# Altium project DC-DC_BuckBoost.PrjPcb (part 1 of 2)
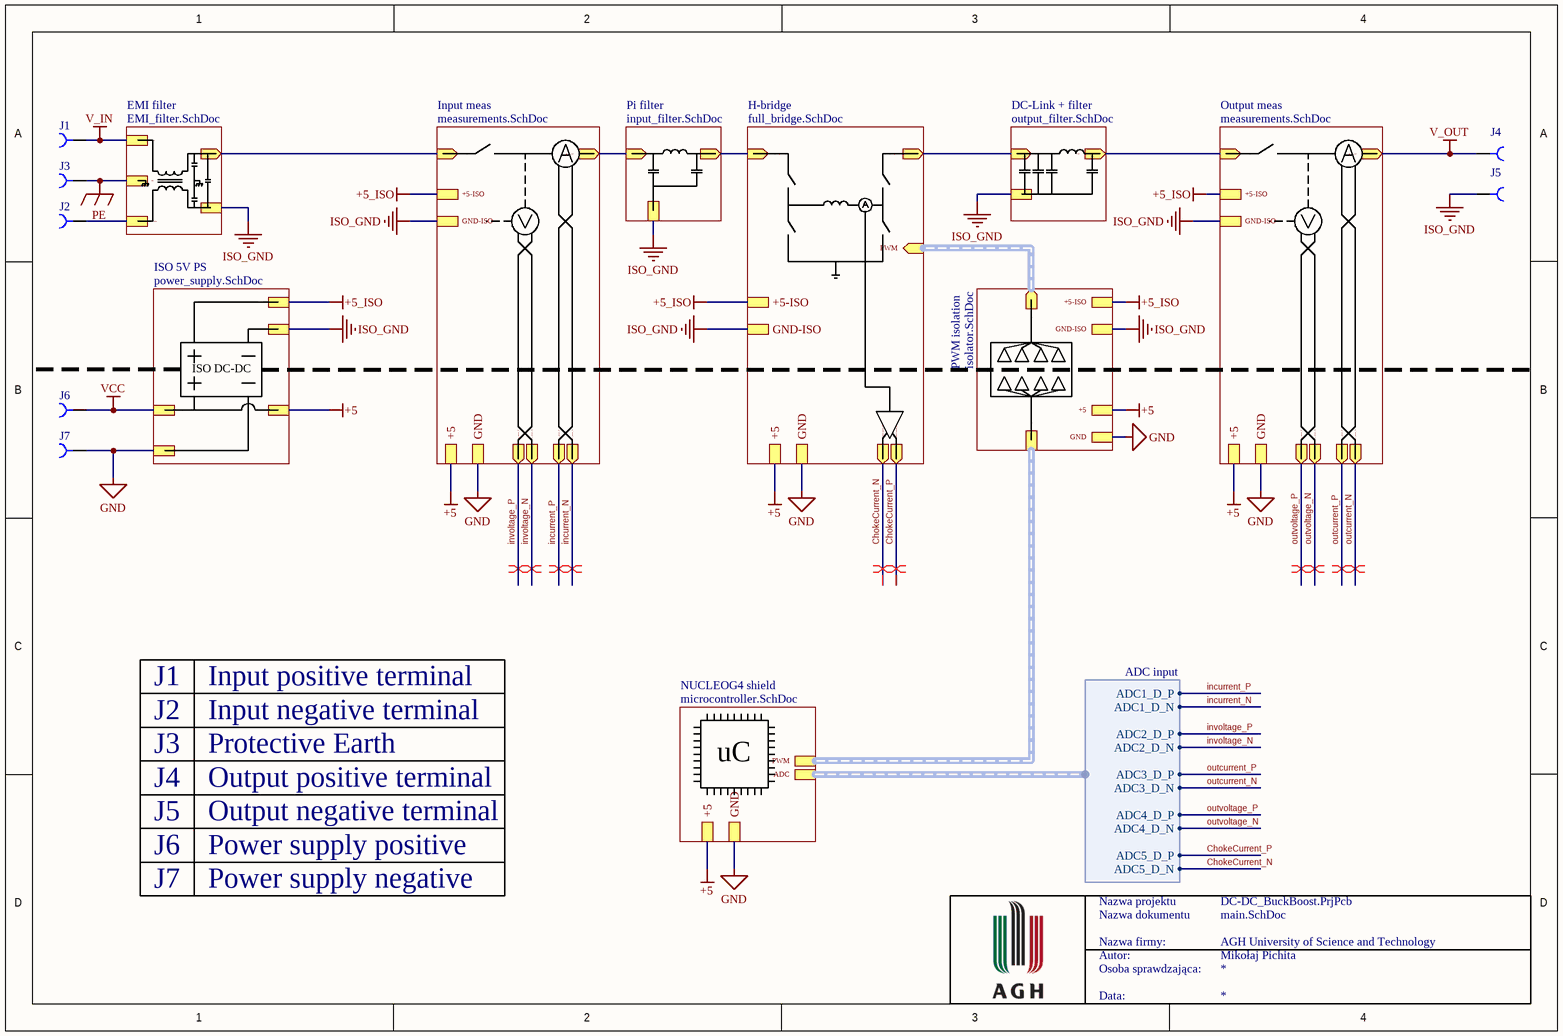
[diagram p0: main.SchDoc]
15 sheets, 255 parts. Net scope: strictly hierarchical (ports join the sheet entries above them; power ports are local).
Board file: PCB.PcbDoc
Sheets:
  main.SchDoc
    Output meas = measurements.SchDoc
      AMC3302 circuit = current_sense_shunt.SchDoc
      AMC3330 circuit = voltage_sense.SchDoc
      Protection = OV_OC.SchDoc
    Input meas = measurements.SchDoc
      AMC3302 circuit = current_sense_shunt.SchDoc
      AMC3330 circuit = voltage_sense.SchDoc
      Protection = OV_OC.SchDoc
    Pi filter = input_filter.SchDoc
    H-bridge = full_bridge.SchDoc
      Choke voltage = testpoint.SchDoc
      Designator = choke_current_meas.SchDoc
    DC-Link + filter = output_filter.SchDoc
    ISO 5V PS = power_supply.SchDoc
    PWM isolation = isolator.SchDoc
      PWM1and2 = testpoint.SchDoc
      PWM3and4 = testpoint.SchDoc
    NUCLEOG4 shield = microcontroller.SchDoc
    EMI filter = EMI_filter.SchDoc
  Drawing.SchDoc

## Sheet main.SchDoc
size A4; Author: Mikołaj Pichita; CompanyName: AGH University of Science and Technology; SheetNumber: 2; SheetTotal: 16

### Parts
J1  RED  [571-0X00]  (value not drawn)
J2  BLACK  [571-0X00]  (value not drawn)
J3  GREEN  [571-0X00]  (value not drawn)
J4  RED  [571-0X00]  (value not drawn)
J5  BLACK  [571-0X00]  (value not drawn)
J6  RED  [571-0X00]  (value not drawn)
J7  BLACK  [571-0X00]  (value not drawn)

### Sub-sheets
DC-Link + filter = output_filter.SchDoc: In (in), Out (out), GND-ISO
EMI filter = EMI_filter.SchDoc: Line, Return, NEG, POS (out), PE
H-bridge = full_bridge.SchDoc: Hi_side_in (in), Hi_side_out (out), PWM (in, harness Isolated PWM), ChokeCurrent_P (out), ChokeCurrent_N (out), +5-ISO, GND-ISO, +5, GND
Input meas = measurements.SchDoc: vs_meas_P (out), vs_meas_N (out), cs_meas_P (out), cs_meas_N (out), +5, GND, meas_in (in), meas_out (out), GND-ISO, +5-ISO
ISO 5V PS = power_supply.SchDoc: Vcc_in, +5, +5-ISO, GND, GND-ISO
NUCLEOG4 shield = microcontroller.SchDoc: PWM (harness Non isolated PWM), ADC (harness ADC input), +5, GND
Output meas = measurements.SchDoc: vs_meas_P (out), vs_meas_N (out), cs_meas_P (out), cs_meas_N (out), +5, GND, meas_in (in), meas_out (out), GND-ISO, +5-ISO
Pi filter = input_filter.SchDoc: In (in), Out (out), GND-ISO
PWM isolation = isolator.SchDoc: iso_out (out, harness Isolated PWM), iso_in (harness Non isolated PWM), +5-ISO, GND-ISO, +5, GND

### Harnesses
ADC input: ADC1_D_N, ADC1_D_P, ADC2_D_N, ADC2_D_P, ADC3_D_N, ADC3_D_P, ADC4_D_N, ADC4_D_P, ADC5_D_P, ADC5_D_N

### Nets
+5: sheet Output meas/+5, sheet Input meas/+5, sheet H-bridge/+5, sheet ISO 5V PS/+5, sheet PWM isolation/+5, sheet NUCLEOG4 shield/+5
+5_ISO: sheet Output meas/+5-ISO, sheet Input meas/+5-ISO, sheet H-bridge/+5-ISO, sheet ISO 5V PS/+5-ISO, sheet PWM isolation/+5-ISO
GND: J7.1 ; sheet Output meas/GND, sheet Input meas/GND, sheet H-bridge/GND, sheet ISO 5V PS/GND, sheet PWM isolation/GND, sheet NUCLEOG4 shield/GND
ISO_GND: J5.1 ; sheet Output meas/GND-ISO, sheet Input meas/GND-ISO, sheet Pi filter/GND-ISO, sheet H-bridge/GND-ISO, sheet DC-Link + filter/GND-ISO, sheet ISO 5V PS/GND-ISO, sheet PWM isolation/GND-ISO, sheet EMI filter/NEG
PE: J3.1 ; sheet EMI filter/PE
V_IN: J1.1 ; sheet EMI filter/Line
V_OUT: J4.1 ; sheet Output meas/meas_out
VCC: J6.1 ; sheet ISO 5V PS/Vcc_in
ChokeCurrent_N: sheet H-bridge/ChokeCurrent_N, sheet NUCLEOG4 shield/ADC.ADC5_D_N
ChokeCurrent_P: sheet H-bridge/ChokeCurrent_P, sheet NUCLEOG4 shield/ADC.ADC5_D_P
FltrIn: sheet Input meas/meas_out, sheet Pi filter/In
incurrent_N: sheet Input meas/cs_meas_N, sheet NUCLEOG4 shield/ADC.ADC1_D_N
incurrent_P: sheet Input meas/cs_meas_P, sheet NUCLEOG4 shield/ADC.ADC1_D_P
involtage_N: sheet Input meas/vs_meas_N, sheet NUCLEOG4 shield/ADC.ADC2_D_N
involtage_P: sheet Input meas/vs_meas_P, sheet NUCLEOG4 shield/ADC.ADC2_D_P
outcurrent_N: sheet Output meas/cs_meas_N, sheet NUCLEOG4 shield/ADC.ADC3_D_N
outcurrent_P: sheet Output meas/cs_meas_P, sheet NUCLEOG4 shield/ADC.ADC3_D_P
OutFltr: sheet Output meas/meas_in, sheet DC-Link + filter/Out
outvoltage_N: sheet Output meas/vs_meas_N, sheet NUCLEOG4 shield/ADC.ADC4_D_N
outvoltage_P: sheet Output meas/vs_meas_P, sheet NUCLEOG4 shield/ADC.ADC4_D_P
Return: J2.1 ; sheet EMI filter/Return
VCCFltr: sheet Input meas/meas_in, sheet EMI filter/POS
Vin: sheet Pi filter/Out, sheet H-bridge/Hi_side_in
Vout: sheet H-bridge/Hi_side_out, sheet DC-Link + filter/In

### Buses and harness runs
harness sheet H-bridge/PWM = sheet PWM isolation/iso_out
harness sheet NUCLEOG4 shield/PWM = sheet PWM isolation/iso_in

### Layout directives
differential pair: ChokeCurrent_N, ChokeCurrent_P, incurrent_N, incurrent_P, involtage_N, involtage_P, outcurrent_N, outcurrent_P, outvoltage_N, outvoltage_P

### Notes on the sheet
- ISO DC-DC
- J1
- Input positive terminal
- J2
- J3
- J4
- Input negative terminal
- Protective Earth
- Output positive terminal
- uC
- J5
- Output negative terminal
- J6
- J7
- Power supply positive
- Power supply negative
- Nazwa projektu
- Nazwa dokumentu
- Nazwa firmy:
- Autor:
- Osoba sprawdzająca:
- Data:

### Library data of the parts
J1-J7 = Banana connector: Value: *; HelpURL: *; MPN: *; Supplier: *; SupplierPartNumber: *

## Sheet measurements.SchDoc
size A4; Date: 04.12.2023; ApprovedBy: Cezary Worek; Author: Mikołaj Pichita; CompanyName: AGH University of Science and Technology; SheetNumber: 12; SheetTotal: 16
Used 2 times, as channels Output meas, Input meas. Parts and nets are listed once, with the designators drawn on the sheet.
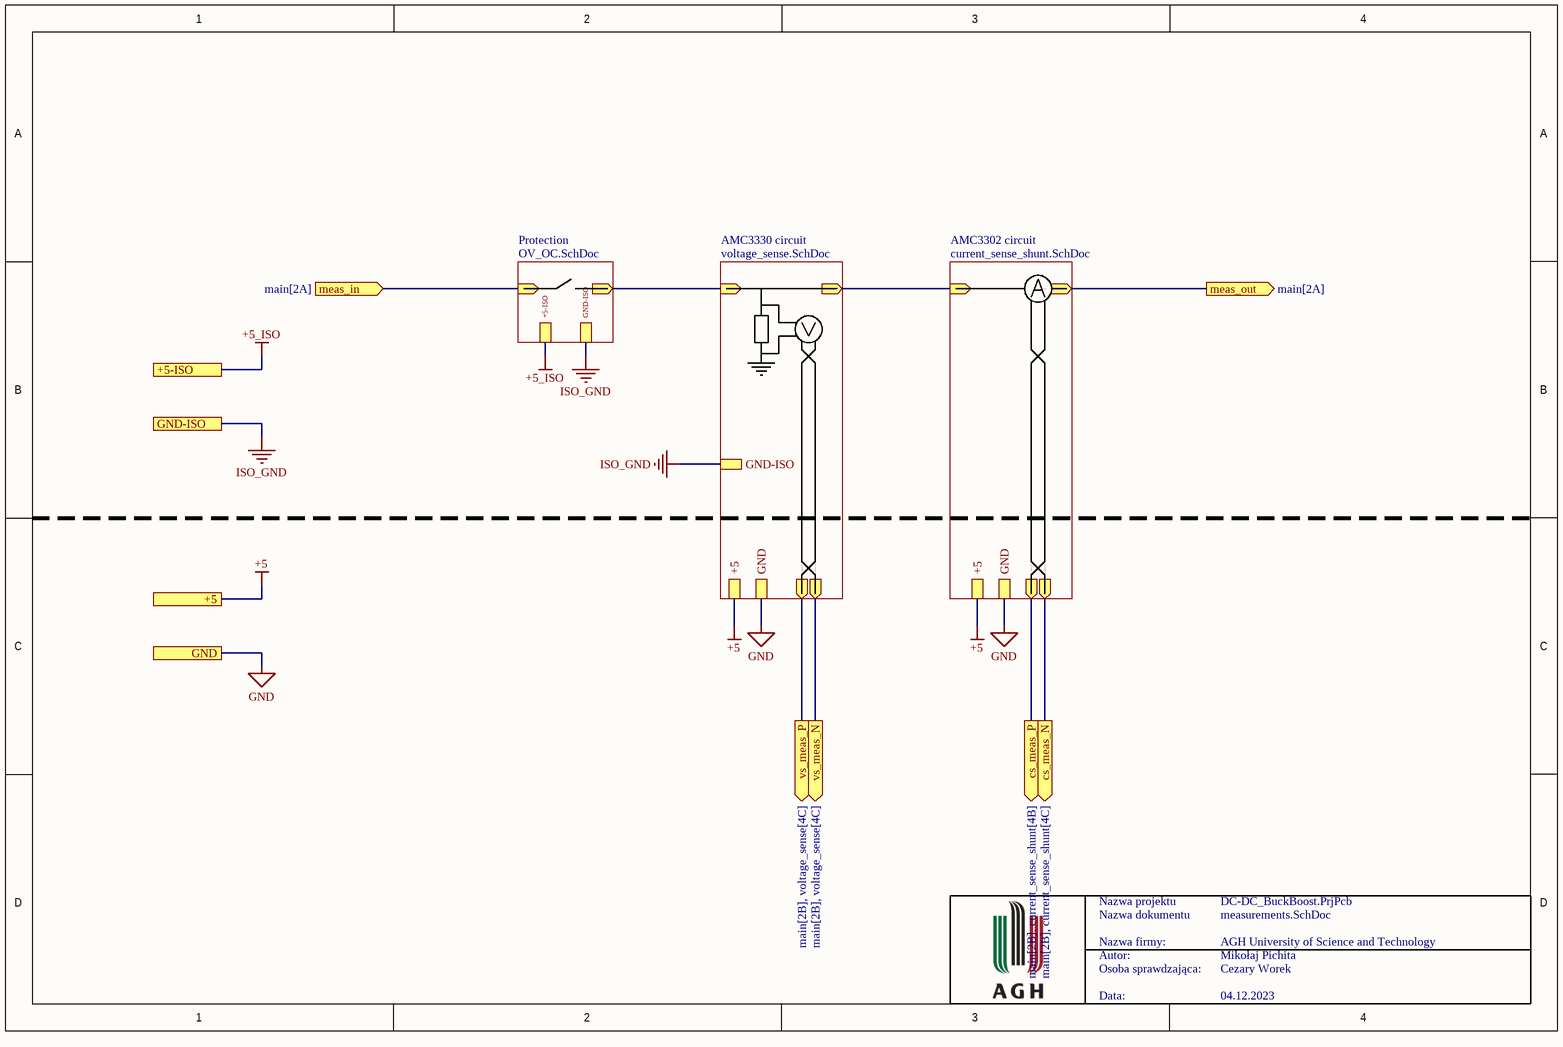
[diagram p1: measurements.SchDoc]

### Sub-sheets
AMC3302 circuit = current_sense_shunt.SchDoc: cs_in (in), cs_out (out), cs_meas_P (out), cs_meas_N (out), +5, GND
AMC3330 circuit = voltage_sense.SchDoc: vs_in (in), vs_out (out), vs_meas_P (out), vs_meas_N (out), +5, GND, GND-ISO
Protection = OV_OC.SchDoc: In (in), Out (out), +5-ISO, GND-ISO

### Ports
+5 (see main[2B], choke_current_meas[4B], current_sense_shunt[4A], full_bridge[1C], isolator[1B], microcontroller[1C], power_supply[2B], voltage_sense[4A]), +5-ISO (see main[2A], full_bridge[1B], isolator[4B], OV_OC[1B], power_supply[3B], testpoint[2A]), cs_meas_N (out, see main[2B], current_sense_shunt[4C]), cs_meas_P (out, see main[2B], current_sense_shunt[4B]), GND (see main[2B], choke_current_meas[4B], current_sense_shunt[4B], full_bridge[1D], isolator[1B], microcontroller[1C], power_supply[1B], voltage_sense[4B]), GND-ISO (see main[2A], full_bridge[1B], input_filter[2C], isolator[4B], output_filter[1B], OV_OC[1B], power_supply[3B], testpoint[2A], voltage_sense[1B]), meas_in (in, see main[2A]), meas_out (out, see main[2A]), vs_meas_N (out, see main[2B], voltage_sense[4C]), vs_meas_P (out, see main[2B], voltage_sense[4C])

### Nets
+5: port +5, sheet AMC3302 circuit/+5, sheet AMC3330 circuit/+5
+5_ISO: port +5-ISO, sheet Protection/+5-ISO
GND: port GND, sheet AMC3302 circuit/GND, sheet AMC3330 circuit/GND
ISO_GND: port GND-ISO, sheet AMC3330 circuit/GND-ISO, sheet Protection/GND-ISO
cs_meas_N: port cs_meas_N, sheet AMC3302 circuit/cs_meas_N
cs_meas_P: port cs_meas_P, sheet AMC3302 circuit/cs_meas_P
meas_in: port meas_in, sheet Protection/In
meas_out: port meas_out, sheet AMC3302 circuit/cs_out
vs_meas_N: port vs_meas_N, sheet AMC3330 circuit/vs_meas_N
vs_meas_P: port vs_meas_P, sheet AMC3330 circuit/vs_meas_P
(unnamed): sheet AMC3302 circuit/cs_in, sheet AMC3330 circuit/vs_out
(unnamed): sheet AMC3330 circuit/vs_in, sheet Protection/Out

### Channels
Output meas: ports +5-ISO=+5_ISO +5=+5 cs_meas_N=outcurrent_N cs_meas_P=outcurrent_P GND-ISO=ISO_GND GND=GND meas_in=OutFltr meas_out=V_OUT vs_meas_N=outvoltage_N vs_meas_P=outvoltage_P
Input meas: ports +5-ISO=+5_ISO +5=+5 cs_meas_N=incurrent_N cs_meas_P=incurrent_P GND-ISO=ISO_GND GND=GND meas_in=VCCFltr meas_out=FltrIn vs_meas_N=involtage_N vs_meas_P=involtage_P

### Notes on the sheet
- Nazwa projektu
- Nazwa dokumentu
- Nazwa firmy:
- Autor:
- Osoba sprawdzająca:
- Data:

## Sheet current_sense_shunt.SchDoc
size A4; Author: Mikołaj Pichita; CompanyName: AGH University of Science and Technology; SheetNumber: 15; SheetTotal: 16
Used 2 times, as channels Output meas/AMC3302 circuit, Input meas/AMC3302 circuit. Parts and nets are listed once, with the designators drawn on the sheet.
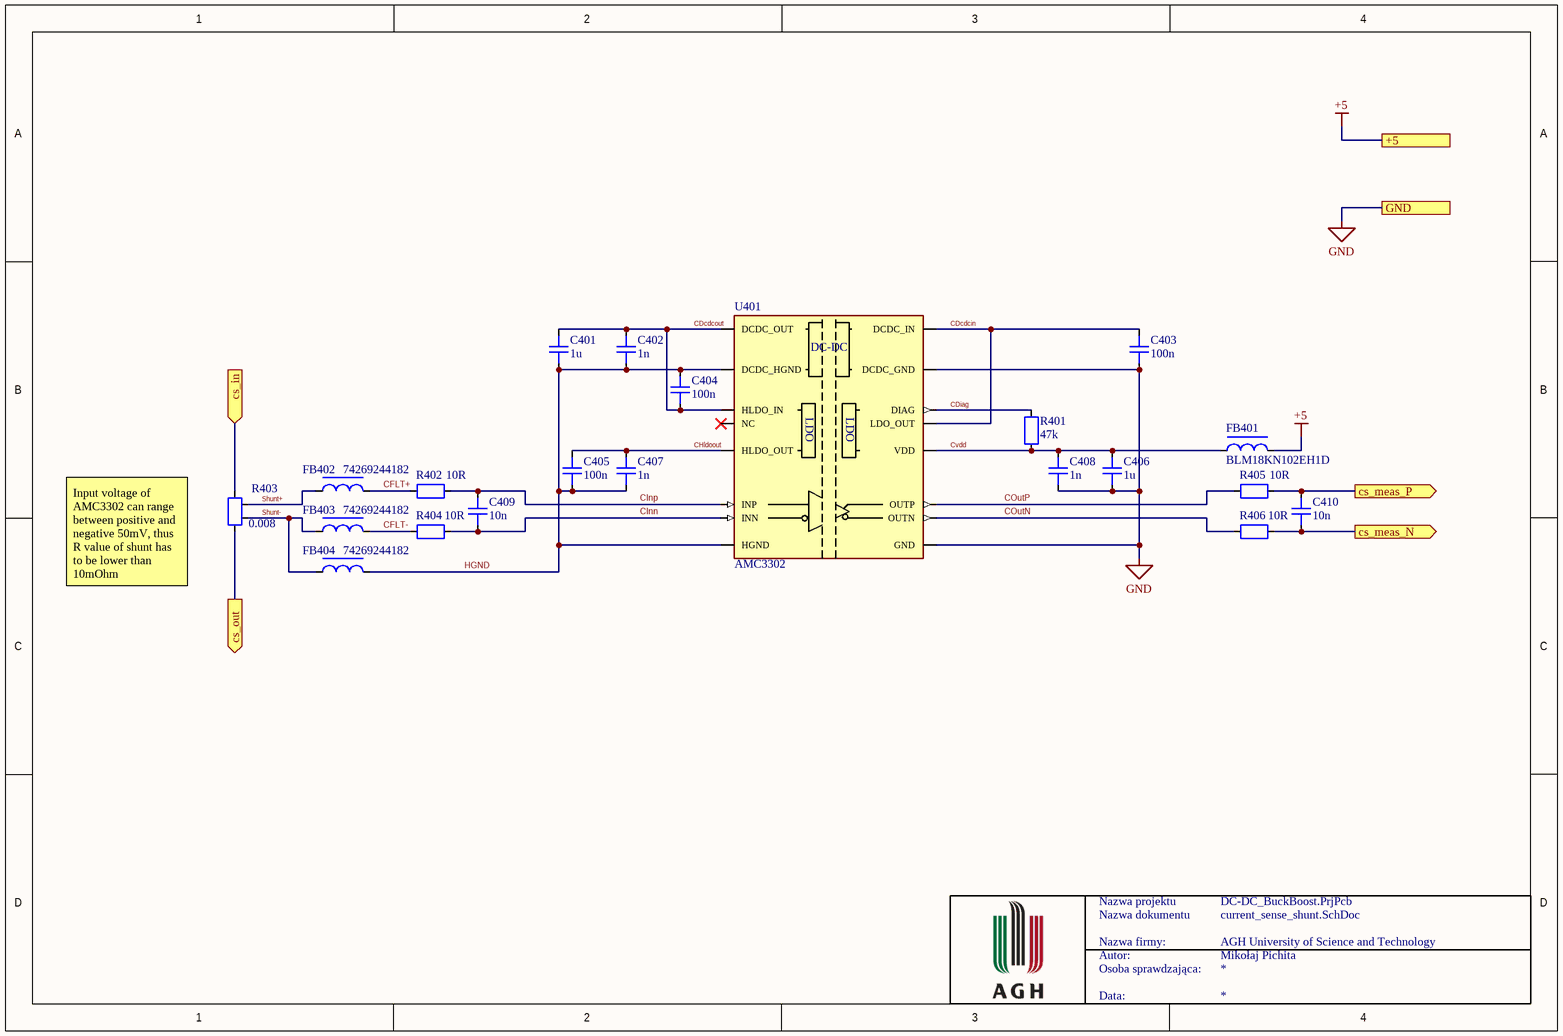
[diagram p2: current_sense_shunt.SchDoc]

### Parts
C401  1u  [CAP1206]
C402  1n  [CAP0603]
C403  100n  [CAP0603]
C404  100n  [CAP0603]
C405  100n  [CAP0603]
C406  1u  [CAP1206]
C407  1n  [CAP0603]
C408  1n  [CAP1206]
C409  10n  [CAP0603]
C410  10n  [CAP0603]
FB401  BLM18KN102EH1D  [RES0603]
FB402  74269244182  [FB0402]
FB403  74269244182  [FB0402]
FB404  74269244182  [FB0402]
R401  47k  [RES0603]
R402  10R  [RES0603]
R403  0.008  [WSL3637]
R404  10R  [RES0603]
R405  10R  [RES0603]
R406  10R  [RES0603]
U401  AMC3302  [SOIC127P1030X265-16N]

### Ports
+5 (see measurements[3C], choke_current_meas[4B], full_bridge[1C], isolator[1B], measurements[1C], microcontroller[1C], power_supply[2B], voltage_sense[4A]), cs_in (in, see measurements[3B]), cs_meas_N (out, see measurements[3C], measurements[3D]), cs_meas_P (out, see measurements[3C], measurements[3D]), cs_out (out, see measurements[3B]), GND (see measurements[3C], choke_current_meas[4B], full_bridge[1D], isolator[1B], measurements[1C], microcontroller[1C], power_supply[1B], voltage_sense[4B])

### Nets
+5: FB401.1 ; port +5
GND: C403.2 C406.2 C408.2 U401.9(GND) U401.15(DCDC_GND) ; port GND
CDcdcin: C403.1 U401.13(LDO_OUT) U401.16(DCDC_IN)
CDcdcout: C401.1 C402.1 C404.2 U401.1(DCDC_OUT) U401.3(HLDO_IN)
CDiag: R401.1 U401.14(DIAG)
CFLT+: FB402.2 R402.2
CFLT-: FB403.2 R404.2
CHldoout: C405.1 C407.1 U401.5(HLDO_OUT)
CInn: C409.1 R404.1 U401.7(INN)
CInp: C409.2 R402.1 U401.6(INP)
COutN: R406.2 U401.10(OUTN)
COutP: R405.2 U401.11(OUTP)
cs_in: R403.1 ; port cs_in
cs_meas_N: C410.1 R406.1 ; port cs_meas_N
cs_meas_P: C410.2 R405.1 ; port cs_meas_P
cs_out: R403.2 ; port cs_out
Cvdd: C406.1 C408.1 FB401.2 R401.2 U401.12(VDD)
HGND: C401.2 C402.2 C404.1 C405.2 C407.2 FB404.2 U401.2(DCDC_HGND) U401.8(HGND)
Shunt+: FB402.1 R403.4
Shunt-: FB403.1 FB404.1 R403.3

Not connected (* = marked no-connect by the designer): U401 4(NC)*

### Channels
Output meas/AMC3302 circuit: designators end in A; ports +5=+5 cs_in=VCCProt cs_meas_N=outcurrent_N cs_meas_P=outcurrent_P cs_out=V_OUT GND=GND
Input meas/AMC3302 circuit: designators end in B; ports +5=+5 cs_in=VCCProt cs_meas_N=incurrent_N cs_meas_P=incurrent_P cs_out=FltrIn GND=GND

### Notes on the sheet
- (near R403) Input voltage of AMC3302 can range between positive and negative 50mV, thus R value of shunt has to be lower than 10mOhm
- Nazwa projektu
- Nazwa dokumentu
- Nazwa firmy:
- Autor:
- Osoba sprawdzająca:
- Data:
- (in symbol AMC3302) DC-DC; LDO

### Library data of the parts
C401-C410 = Capacitor: Value: *; HelpURL: *; MPN: *; Supplier: *; SupplierPartNumber: *; Supplier 1: Mouser
  C401 C406: Supplier Part Number 1: 581-12065C105K4Z4A
  C402 C407: Supplier Part Number 1: 581-0603YC102J4T2A
  C403-C405: Supplier Part Number 1: 581-06035C104KAT2A
  C408: Supplier Part Number 1: 581-1206GC102KAT3A
  C409 C410: Supplier Part Number 1: 581-06035C103K
FB401-FB404 = Ferrite Bead: Value: *; HelpURL: *; MPN: *; Supplier: *; SupplierPartNumber: *; Supplier 1: Mouser
  FB401: Supplier Part Number 1: 81-BLM18KN102EH1D
  FB402-FB404: Supplier Part Number 1: 710-74269244182
R401 R402 R404-R406 = Resistor: Value: *; HelpURL: *; MPN: *; Supplier: *; SupplierPartNumber: *; Supplier 1: Mouser
  R401: Supplier Part Number 1: 603-RP0603BRD0747KL
  R402 R404-R406: Supplier Part Number 1: 603-RP0603BRD0710RL
R403 = Shunt resistor: 0.008 Ohm Current Sense Resistor; Value: *; HelpURL: *; MPN: *; Supplier: *; SupplierPartNumber: *; Supplier 1: Mouser; Supplier Part Number 1: 71-WSL36378L000FEA
U401 = AMC3302: ±50-mV input, precision current sensing reinforced isolated amplifier with integrated DC/DC; Value: *; HelpURL: *; MPN: *; Supplier: *; SupplierPartNumber: *

## Sheet voltage_sense.SchDoc
size A4; Author: Mikołaj Pichita; CompanyName: AGH University of Science and Technology; SheetNumber: 14; SheetTotal: 16
Used 2 times, as channels Output meas/AMC3330 circuit, Input meas/AMC3330 circuit. Parts and nets are listed once, with the designators drawn on the sheet.
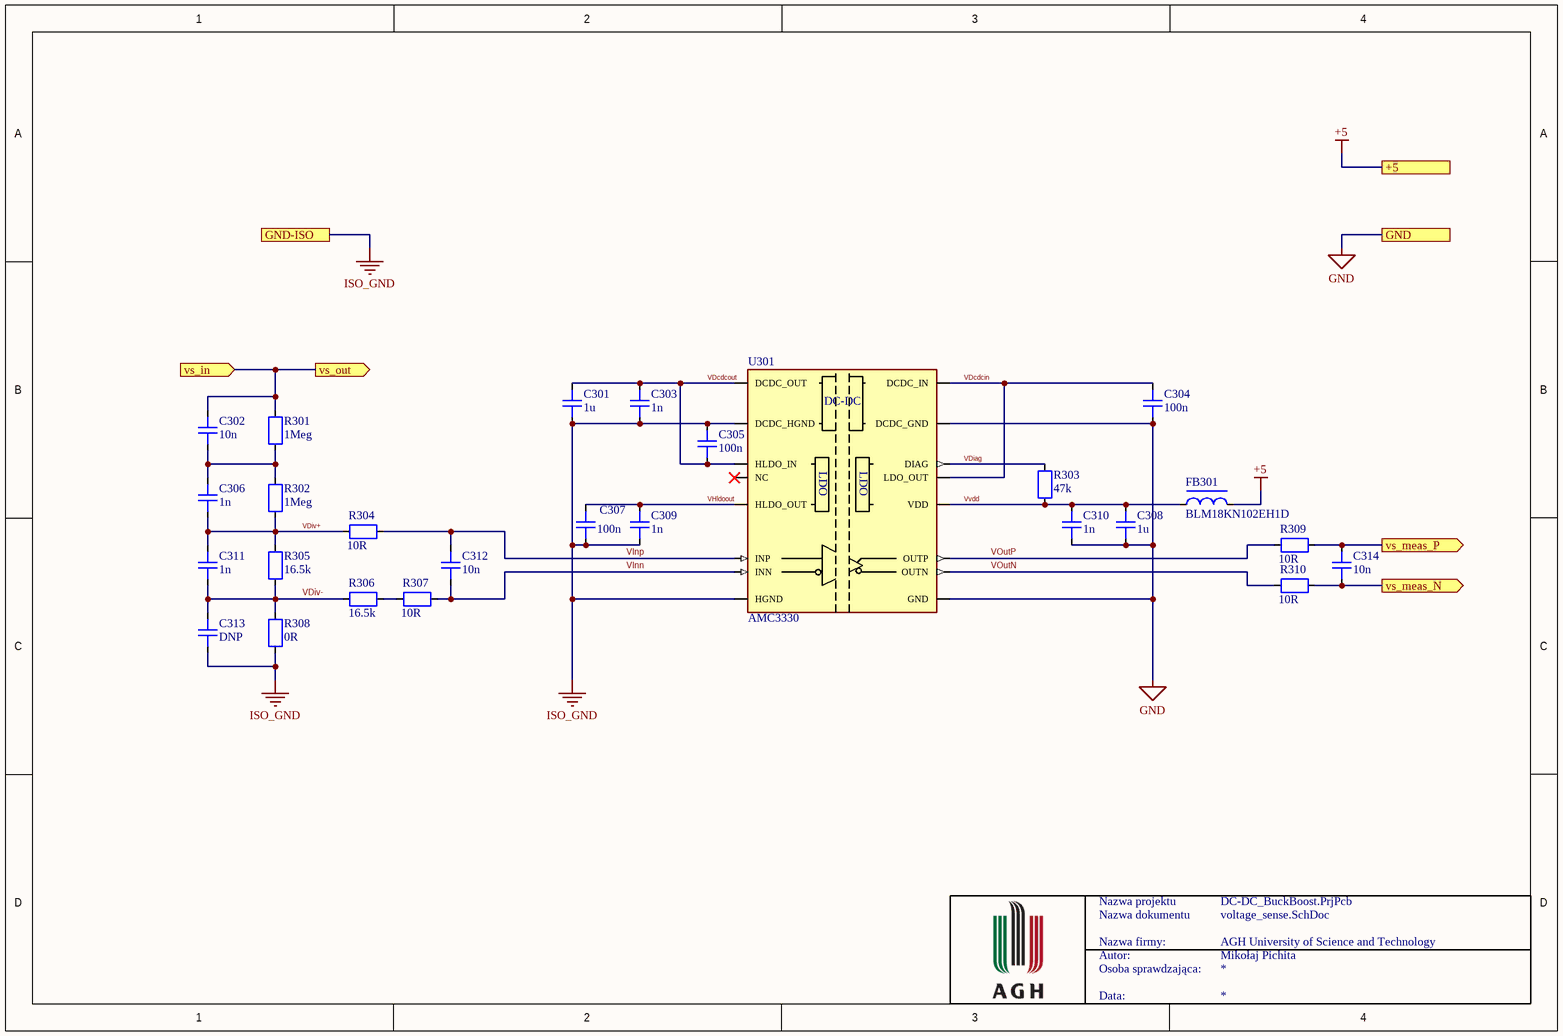
[diagram p3: voltage_sense.SchDoc]

### Parts
C301  1u  [CAP1206]
C302  10n  [CAP0603]
C303  1n  [CAP0603]
C304  100n  [CAP0603]
C305  100n  [CAP0603]
C306  1n  [CAP0603]
C307  100n  [CAP0603]
C308  1u  [CAP1206]
C309  1n  [CAP0603]
C310  1n  [CAP1206]
C311  1n  [CAP0603]
C312  10n  [CAP0603]
C313  DNP  [CAP0603]  (no BOM)
C314  10n  [CAP0603]
FB301  BLM18KN102EH1D  [RES0603]
R301  1Meg  [RES0603]
R302  1Meg  [RES0603]
R303  47k  [RES0603]
R304  10R  [RES0603]
R305  16.5k  [RES0603]
R306  16.5k  [RES0603]
R307  10R  [RES0603]
R308  0R  [RES0603]
R309  10R  [RES0603]
R310  10R  [RES0603]
U301  AMC3330  [SOIC127P1030X265-16N]

### Ports
+5 (see measurements[2C], choke_current_meas[4B], current_sense_shunt[4A], full_bridge[1C], isolator[1B], measurements[1C], microcontroller[1C], power_supply[2B]), GND (see measurements[2C], choke_current_meas[4B], current_sense_shunt[4A], full_bridge[1D], isolator[1B], measurements[1C], microcontroller[1C], power_supply[1B]), GND-ISO (see measurements[2B], full_bridge[1B], input_filter[2C], isolator[4B], measurements[1B], output_filter[1B], OV_OC[1B], power_supply[3B], testpoint[1A]), vs_in (in, see measurements[2B]), vs_meas_N (out, see measurements[3C], measurements[3D]), vs_meas_P (out, see measurements[3C], measurements[3D]), vs_out (out, see measurements[3B])

### Nets
+5: FB301.1 ; port +5
GND: C304.2 C308.2 C310.2 U301.9(GND) U301.15(DCDC_GND) ; port GND
ISO_GND: C301.2 C303.2 C305.1 C307.2 C309.2 C313.2 R308.2 U301.2(DCDC_HGND) U301.8(HGND) ; port GND-ISO
VDcdcin: C304.1 U301.13(LDO_OUT) U301.16(DCDC_IN)
VDcdcout: C301.1 C303.1 C305.2 U301.1(DCDC_OUT) U301.3(HLDO_IN)
VDiag: R303.1 U301.14(DIAG)
VDiv+: C306.2 C311.1 R302.2 R304.2 R305.1
VDiv-: C311.2 C313.1 R305.2 R306.1 R308.1
VHldoout: C307.1 C309.1 U301.5(HLDO_OUT)
VInn: C312.1 R307.1 U301.7(INN)
VInp: C312.2 R304.1 U301.6(INP)
VOutN: R310.2 U301.10(OUTN)
VOutP: R309.2 U301.11(OUTP)
vs_in: C302.1 R301.1 ; port vs_in, port vs_out
vs_meas_N: C314.1 R310.1 ; port vs_meas_N
vs_meas_P: C314.2 R309.1 ; port vs_meas_P
Vvdd: C308.1 C310.1 FB301.2 R303.2 U301.12(VDD)
NetC302_2: C302.2 C306.1 R301.2 R302.1
NetR306_2: R306.2 R307.2

Not connected (* = marked no-connect by the designer): U301 4(NC)*

### Channels
Output meas/AMC3330 circuit: designators end in A; ports +5=+5 GND-ISO=ISO_GND GND=GND vs_in=VCCProt vs_meas_N=outvoltage_N vs_meas_P=outvoltage_P vs_out=VCCProt
Input meas/AMC3330 circuit: designators end in B; ports +5=+5 GND-ISO=ISO_GND GND=GND vs_in=VCCProt vs_meas_N=involtage_N vs_meas_P=involtage_P vs_out=VCCProt

### Notes on the sheet
- Nazwa projektu
- Nazwa dokumentu
- Nazwa firmy:
- Autor:
- Osoba sprawdzająca:
- Data:
- (in symbol AMC3330) DC-DC; LDO

### Library data of the parts
C301-C314 = Capacitor: Value: *; HelpURL: *; MPN: *; Supplier: *; SupplierPartNumber: *
  C301 C308: Supplier 1: Mouser; Supplier Part Number 1: 581-12065C105K4Z4A
  C303 C309: Supplier 1: Mouser; Supplier Part Number 1: 581-0603YC102J4T2A
  C304 C305 C307: Supplier 1: Mouser; Supplier Part Number 1: 581-06035C104KAT2A
  C310: Supplier 1: Mouser; Supplier Part Number 1: 581-1206GC102KAT3A
  C312 C314: Supplier 1: Mouser; Supplier Part Number 1: 581-06035C103K
FB301 = Ferrite Bead: Value: *; HelpURL: *; MPN: *; Supplier: *; SupplierPartNumber: *; Supplier 1: Mouser; Supplier Part Number 1: 81-BLM18KN102EH1D
R301-R310 = Resistor: Value: *; HelpURL: *; MPN: *; Supplier: *; SupplierPartNumber: *; Supplier 1: Mouser
  R301 R302 R308: Supplier Part Number 1: 667-ERJ-UP3F1004V
  R303: Supplier Part Number 1: 603-RP0603BRD0747KL
  R304 R307 R309 R310: Supplier Part Number 1: 603-RP0603BRD0710RL
  R305 R306: Supplier Part Number 1: 603-RT0603DRE0716K5L
U301 = AMC3330: ±1-V input, precision voltage sensing reinforced isolated amplifier with integrated DC/DC; Value: *; HelpURL: *; MPN: *; Supplier: *; SupplierPartNumber: *

## Sheet OV_OC.SchDoc
size A4; Author: Mikołaj Pichita; CompanyName: AGH University of Science and Technology; SheetNumber: 13; SheetTotal: 16
Used 2 times, as channels Output meas/Protection, Input meas/Protection. Parts and nets are listed once, with the designators drawn on the sheet.
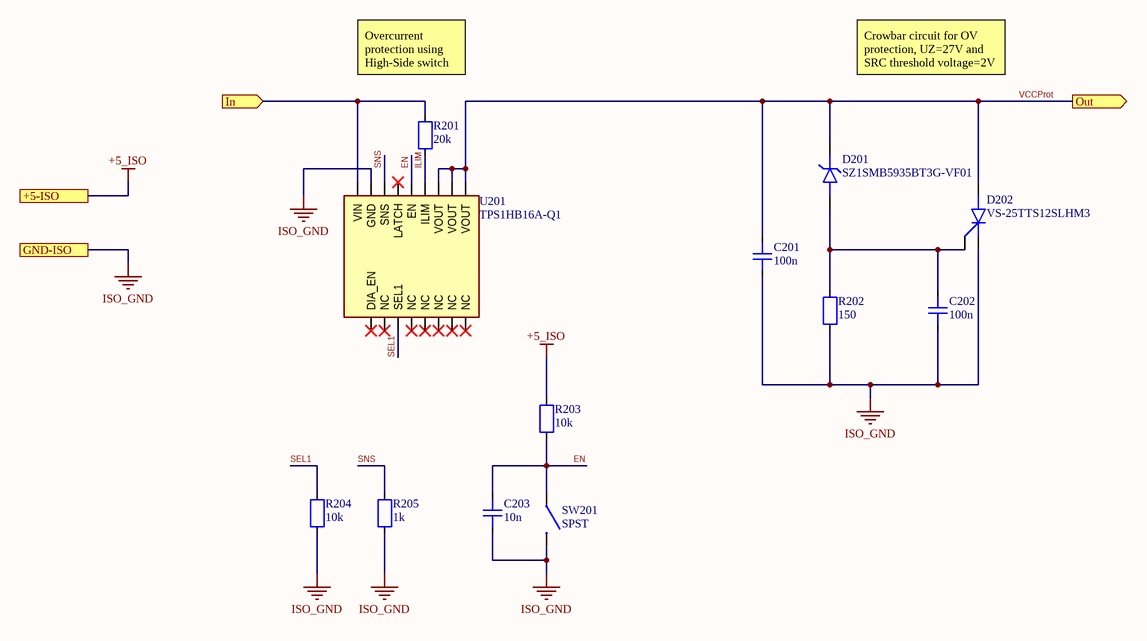
[diagram p4: OV_OC.SchDoc]

### Parts
C201  100n  [CAP0603]
C202  100n  [CAP0603]
C203  10n  [CAP0603]
D201  SZ1SMB5935BT3G-VF01  [DIOM5334X23N]
D202  VS-25TTS12SLHM3  [DPAK254P1524X483-3N]
R201  20k  [RES0603]
R202  150  [RES0603]
R203  10k  [RES0603]
R204  10k  [RES0603]
R205  1k  [RES0603]
SW201  SPST  [SPSTSW]
U201  TPS1HB16A-Q1  [TSOP65P640X120_HS-17N]

### Ports
+5-ISO (see measurements[2B], full_bridge[1B], isolator[4B], measurements[1B], power_supply[3B], testpoint[2A]), GND-ISO (see measurements[2B], full_bridge[1B], input_filter[2C], isolator[4B], measurements[1B], output_filter[1B], power_supply[3B], testpoint[2A], voltage_sense[1B]), In (in, see measurements[2B]), Out (out, see measurements[2B])

### Nets
+5_ISO: R203.1 ; port +5-ISO
ISO_GND: C201.2 C202.2 C203.2 D202.1(Cathode) R202.2 R204.2 R205.2 SW201.2 U201.1(GND) ; port GND-ISO
EN: C203.1 R203.2 SW201.1 U201.4(EN)
ILIM: R201.2 U201.5(ILIM)
In: R201.1 U201.17(VIN) ; port In
SEL1: R204.1 U201.14(SEL1)
SNS: R205.1 U201.2(SNS)
VCCProt: C201.1 D201.1(Cathode) D202.4(Anode) U201.6(VOUT) U201.7(VOUT) U201.8(VOUT) ; port Out
NetC202_1: C202.1 D201.2(Anode) D202.3(Gate) R202.1

Not connected (* = marked no-connect by the designer): U201 3(LATCH)* 9(NC)* 10(NC)* 11(NC)* 12(NC)* 13(NC)* 15(NC)* 16(DIA_EN)*

### Channels
Output meas/Protection: designators end in A; ports +5-ISO=+5_ISO GND-ISO=ISO_GND In=OutFltr Out=VCCProt
Input meas/Protection: designators end in B; ports +5-ISO=+5_ISO GND-ISO=ISO_GND In=VCCFltr Out=VCCProt

### Notes on the sheet
- (near R201) Overcurrent protection using High-Side switch
- Crowbar circuit for OV protection, UZ=27V and SRC threshold voltage=2V
- Nazwa projektu
- Nazwa dokumentu
- Nazwa firmy:
- Autor:
- Osoba sprawdzająca:
- Data:

### Library data of the parts
C201-C203 = Capacitor: Value: *; HelpURL: *; MPN: *; Supplier: *; SupplierPartNumber: *
  C201 C203: Supplier 1: Mouser; Supplier Part Number 1: 80-C0603C202J2G
D201 = Zener: Value: *; HelpURL: *; MPN: *; Supplier: *; SupplierPartNumber: *; Supplier 1: Mouser; Supplier Part Number 1: 863-SZ1SMB5935BT3GV1
D202 = VS-25TTS12SLHM3: Thyristor, Surface Mount, Phase Control SCR, 16 A; Value: *; HelpURL: *; MPN: *; Supplier: *; SupplierPartNumber: *; Supplier 1: Mouser; Supplier Part Number 1: 78-VS-25TTS12SLHM3
R201-R205 = Resistor: Value: *; HelpURL: *; MPN: *; Supplier: *; SupplierPartNumber: *; Supplier 1: Mouser
  R201: Supplier Part Number 1: 667-ERJ-H3ED2002V
  R202: Supplier Part Number 1: 71-RCA0603150RJNEA
  R203 R204: Supplier Part Number 1: 71-CRCW060310K0FKED
  R205: Supplier Part Number 1: 652-CR0603FX-1001ELF
SW201 = 1DS04-254-2-01BK-SMT: SPST 24VDC switch; Value: *; HelpURL: *; MPN: *; Supplier: *; SupplierPartNumber: *; Supplier 1: Mouser; Supplier Part Number 1: 490-DS04254201BK-SMT
U201 = TPS1HB16A-Q1: 40-V, 16-mΩ, 1-ch automotive smart high-side switch with adjustable current limit; Value: *; HelpURL: *; MPN: *; Supplier: *; SupplierPartNumber: *; Supplier 1: Mouser; Supplier Part Number 1: 595-TPS1HB16AQPWPRQ1

## Sheet input_filter.SchDoc
size A4; Author: Mikołaj Pichita; CompanyName: AGH University of Science and Technology; SheetNumber: 4; SheetTotal: 16
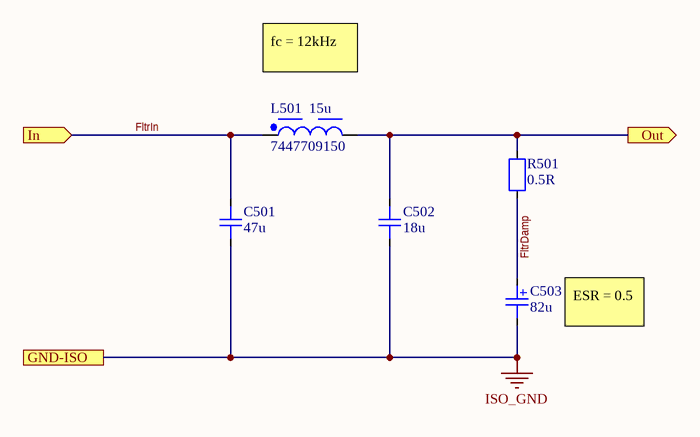
[diagram p5: input_filter.SchDoc]

### Parts
C501  47u  [CAP2220]
C502  18u  [CAP2220]
C503  82u  [WCAP-PSLC_D8H11.7]
L501  7447709150  [WE-PD_1210]
R501  0.5R  [RES0603]

### Ports
GND-ISO (see main[2A], full_bridge[1B], isolator[4B], measurements[1B], output_filter[1B], OV_OC[1B], power_supply[3B], testpoint[1A], voltage_sense[1A]), In (in, see main[2A]), Out (out, see main[2A])

### Nets
ISO_GND: C501.2 C502.2 C503.2 ; port GND-ISO
FltrDamp: C503.1 R501.2
FltrIn: C501.1 L501.1 ; port In
Vin: C502.1 L501.2 R501.1 ; port Out

### Notes on the sheet
- fc = 12kHz
- (near L501) 15u
- (near C503) ESR = 0.5
- Nazwa projektu
- Nazwa dokumentu
- Nazwa firmy:
- Autor:
- Osoba sprawdzająca:
- Data:

### Library data of the parts
C501 = Capacitor: 810-C5750X7R1V476M23; Value: *; HelpURL: *; MPN: *; Supplier: *; SupplierPartNumber: *; Supplier 1: Mouser; Supplier Part Number 1: 810-C5750X7R1V476M23
C502 = Capacitor: 80-C2220C156K5R; Value: *; HelpURL: *; MPN: *; Supplier: *; SupplierPartNumber: *; Supplier 1: Mouser; Supplier Part Number 1: 80-C2220C156K5R
C503 = Capacitor: Value: *; HelpURL: *; MPN: *; Supplier: *; SupplierPartNumber: *; Supplier 1: Mouser; Supplier Part Number 1: 710-875115652006
L501 = CMP-0227-00106-2: NexarPartId: 8917162; Max DC Current: 6.5A; Series Resistance: 26mΩ; Inductance: 15µH; Test Frequency: 1kHz; Core Material: Ferrite; Tolerance: 20%; Shielding: Shielded; Self Resonant Frequency: 17MHz; DC Resistance (DCR): 21mΩ; Saturation Current: 8A; Case/Package: Nonstandard; Composition: Wirewound; Case Code (Imperial): 1210; Width: 12mm; Termination: SMD/SMT; Resistance: 26mΩ; Max Operating Temperature: 125°C; Weight: 9.071847g; Min Operating Temperature: -40°C; Current Rating: 6.5A; Lead Free: Lead Free; Depth: 12mm; Mount: Surface Mount; Height - Seated (Max): 10.0076mm; Packaging: Cut Tape (CT); Case Code (Metric): 3225; Length: 12mm; Ambient Temperature Range High: 85°C; REACH SVHC: Unknown; Ambient Temperature Range Low: -40°C; Lead Pitch: 7mm; RoHS: Compliant; Number of Pins: 2; Inductance Tolerance: 20%; Height: 10mm; RMS Current (Irms): 6.5A
R501 = Resistor: Value: *; HelpURL: *; MPN: *; Supplier: *; SupplierPartNumber: *; Supplier 1: Mouser; Supplier Part Number 1: 71-RCWE0603R500FKEA

## Sheet full_bridge.SchDoc
size A4; Author: Mikołaj Pichita; CompanyName: AGH University of Science and Technology; SheetNumber: 5; SheetTotal: 16
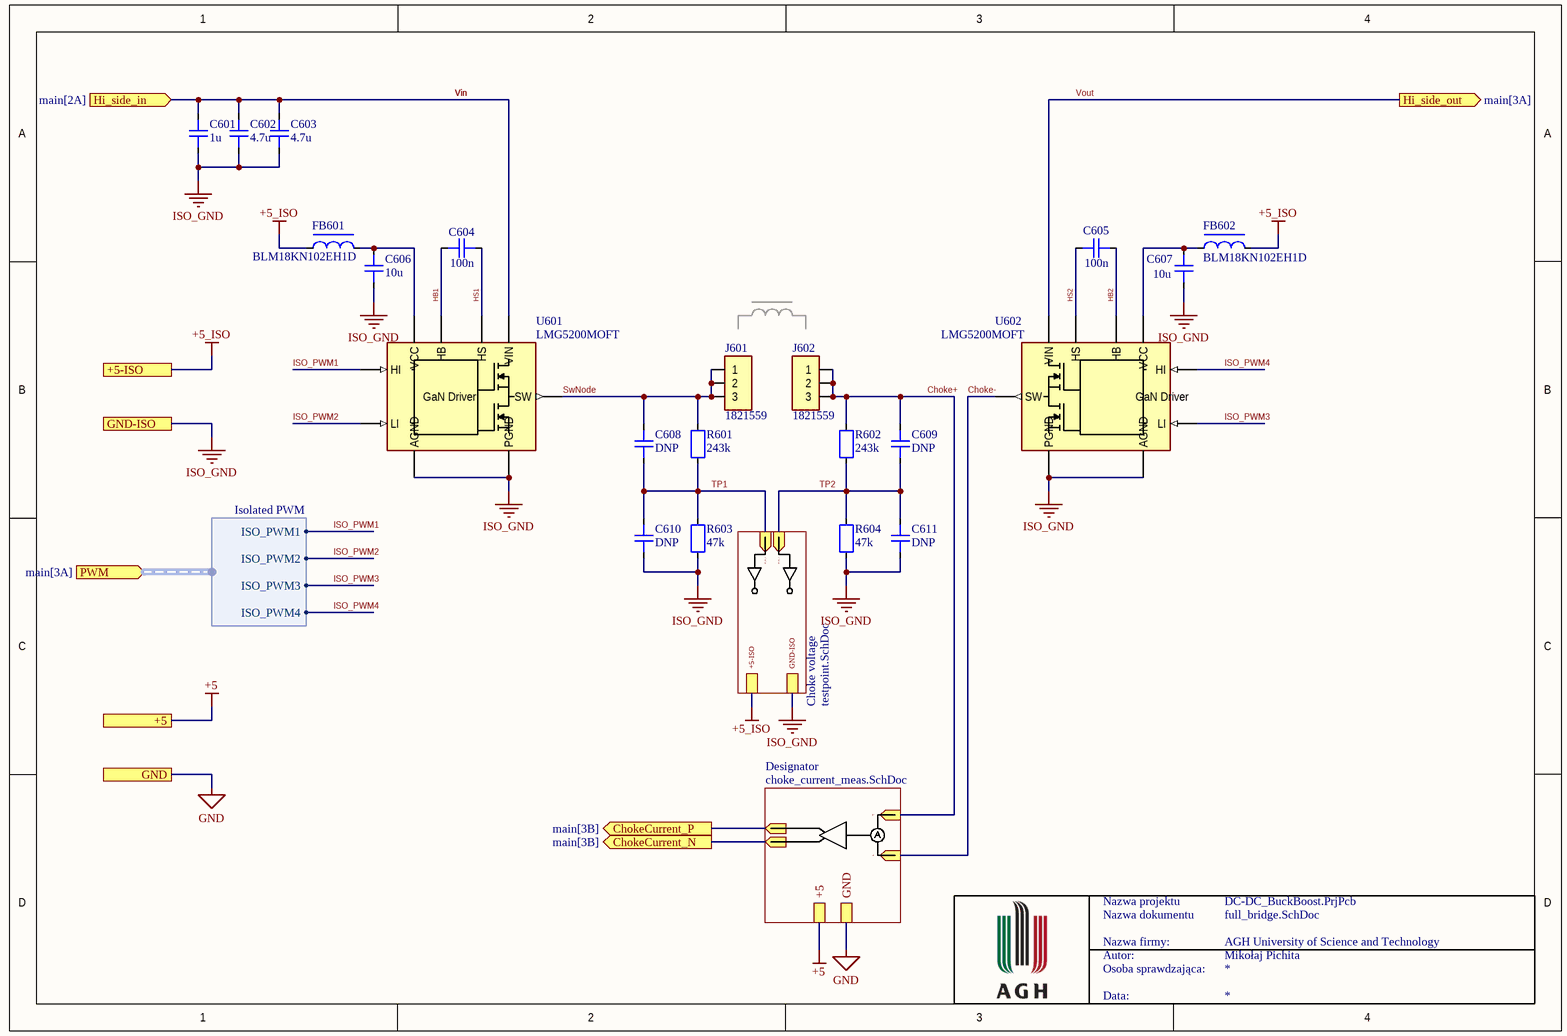
[diagram p6: full_bridge.SchDoc]

### Parts
C601  1u  [CAP0603]
C602  4.7u  [CAP1206]
C603  4.7u  [CAP1206]
C604  100n  [CAP0603]
C605  100n  [CAP0603]
C606  10u  [CAP1206]
C607  10u  [CAP1206]
C608  DNP  [CAP0603]  (no BOM)
C609  DNP  [CAP0603]  (no BOM)
C610  DNP  [CAP0603]  (no BOM)
C611  DNP  [CAP0603]  (no BOM)
FB601  BLM18KN102EH1D  [RES0603]
FB602  BLM18KN102EH1D  [RES0603]
J601  1821559  [1844882]
J602  1821559  [1844882]
R601  243k  [RES0603]
R602  243k  [RES0603]
R603  47k  [RES0603]
R604  47k  [RES0603]
U601  LMG5200MOFT  [FP-MOF0009A-MFG]
U602  LMG5200MOFT  [FP-MOF0009A-MFG]

### Sub-sheets
Choke voltage = testpoint.SchDoc: TP_IN_1 (in), TP_IN_2 (in), +5-ISO, GND-ISO
Designator = choke_current_meas.SchDoc: IP+ (in), IP- (in), measP (out), measN (out), +5, GND

### Ports
+5 (see main[2B], choke_current_meas[4B], current_sense_shunt[4A], isolator[1B], measurements[1C], microcontroller[1C], power_supply[2B], voltage_sense[4A]), +5-ISO (see main[2B], isolator[4B], measurements[1B], OV_OC[1B], power_supply[3B], testpoint[1A]), ChokeCurrent_N (out, see main[3B]), ChokeCurrent_P (out, see main[3B]), GND (see main[3B], choke_current_meas[4B], current_sense_shunt[4A], isolator[1B], measurements[1C], microcontroller[1C], power_supply[1B], voltage_sense[4A]), GND-ISO (see main[2B], input_filter[2C], isolator[4B], measurements[1B], output_filter[1B], OV_OC[1B], power_supply[3B], testpoint[1A], voltage_sense[1A]), Hi_side_in (in, see main[2A]), Hi_side_out (out, see main[3A]), PWM (in, harness Isolated PWM, see main[3A])

### Harnesses
Isolated PWM: ISO_PWM1, ISO_PWM2, ISO_PWM3, ISO_PWM4

### Nets
+5: port +5, sheet Designator/+5
+5_ISO: FB601.1 FB602.1 ; port +5-ISO, sheet Choke voltage/+5-ISO
GND: port GND, sheet Designator/GND
ISO_GND: C601.2 C602.2 C603.2 C606.2 C607.1 C610.2 C611.2 R603.2 R604.2 U601.7(AGND) U601.9(PGND) U602.7(AGND) U602.9(PGND) ; port GND-ISO, sheet Choke voltage/GND-ISO
Choke+: C609.1 J602.1 J602.2 J602.3 R602.1 ; sheet Designator/IP+
Choke-: U602.8(SW) ; sheet Designator/IP-
ChokeCurrent_N: port ChokeCurrent_N, sheet Designator/measN
ChokeCurrent_P: port ChokeCurrent_P, sheet Designator/measP
HB1: C604.2 U601.2(HB)
HB2: C605.1 U602.2(HB)
HS1: C604.1 U601.3(HS)
HS2: C605.2 U602.3(HS)
ISO_PWM1: U601.4(HI) ; port PWM.ISO_PWM1
ISO_PWM2: U601.5(LI) ; port PWM.ISO_PWM2
ISO_PWM3: U602.5(LI) ; port PWM.ISO_PWM3
ISO_PWM4: U602.4(HI) ; port PWM.ISO_PWM4
SwNode: C608.1 J601.1 J601.2 J601.3 R601.1 U601.8(SW)
TP1: C608.2 C610.1 R601.2 R603.1 ; sheet Choke voltage/TP_IN_2
TP2: C609.2 C611.1 R602.2 R604.1 ; sheet Choke voltage/TP_IN_1
Vin: C601.1 C602.1 C603.1 U601.1(VIN) ; port Hi_side_in
Vout: U602.1(VIN) ; port Hi_side_out
NetC606_1: C606.1 FB601.2 U601.6(VCC)
NetC607_2: C607.2 FB602.2 U602.6(VCC)

### Notes on the sheet
- Nazwa projektu
- Nazwa dokumentu
- Nazwa firmy:
- Autor:
- Osoba sprawdzająca:
- Data:
- (in symbol LMG5200MOFT) GaN Driver

### Library data of the parts
C601-C611 = Capacitor: Value: *; HelpURL: *; MPN: *; Supplier: *; SupplierPartNumber: *
  C602 C603: Supplier 1: Mouser; Supplier Part Number 1: 581-12065C475KAT4A
  C604 C605: Supplier 1: Mouser; Supplier Part Number 1: 581-06035C104KAT2A
  C606 C607: Supplier 1: Mouser; Supplier Part Number 1: 581-1206DD106MAT2A
FB601 FB602 = Ferrite Bead: Value: *; HelpURL: *; MPN: *; Supplier: *; SupplierPartNumber: *; Supplier 1: Mouser; Supplier Part Number 1: 81-BLM18KN102EH1D
R601-R604 = Resistor: Value: *; HelpURL: *; MPN: *; Supplier: *; SupplierPartNumber: *; Supplier 1: Mouser
  R601 R602: Supplier Part Number 1: 71-CRCW0603-243K-E3
  R603 R604: Supplier Part Number 1: 603-RC0603FR-0747KL
U601 U602 = LMG5200MOFT: 10-A GaN Half-Bridge Power Stage; Output Current per Channel: 10A; Interface: Logic; Min Operating Temperature: -40°C; Mount: Surface Mount; Case/Package: QFN; RoHS Compliant: Yes; Packaging: Cut Tape; Max Operating Temperature: 125°C; Number of Pins: 9
J601 J602 = 1821559: Value: *; HelpURL: *; MPN: *; Supplier: *; SupplierPartNumber: *; Supplier 1: Mouser; Supplier Part Number 1: 651-1821559

## Sheet testpoint.SchDoc
size A4; Author: Mikołaj Pichita; CompanyName: AGH University of Science and Technology; SheetNumber: 6; SheetTotal: 16
Used 3 times, as channels H-bridge/Choke voltage, PWM isolation/PWM1and2, PWM isolation/PWM3and4. Parts and nets are listed once, with the designators drawn on the sheet.
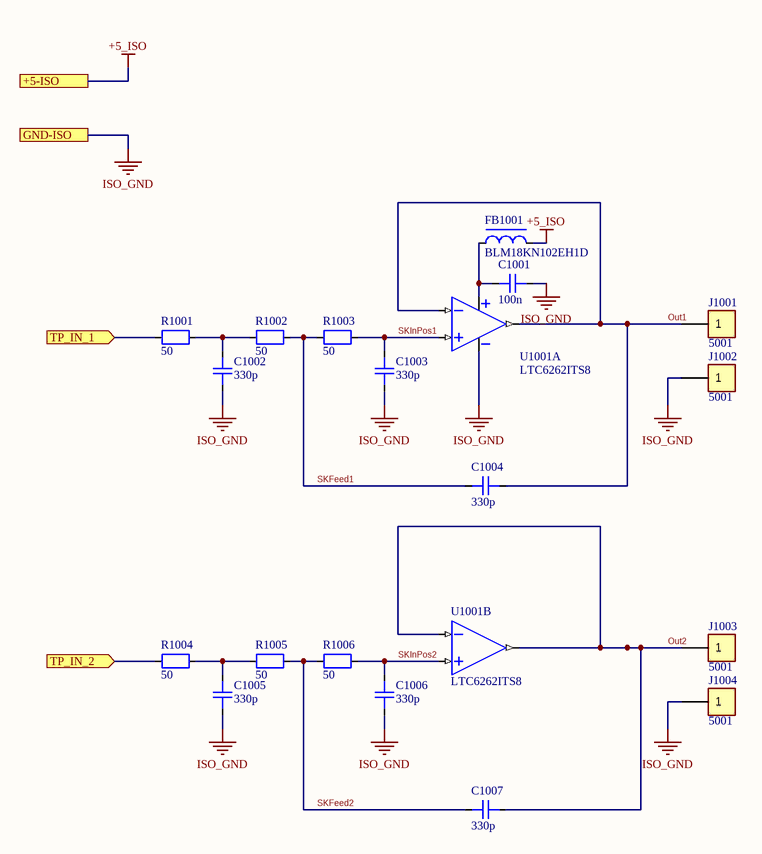
[diagram p7: testpoint.SchDoc]

### Parts
C1001  100n  [CAP0603]
C1002  330p  [CAP0603]
C1003  330p  [CAP0603]
C1004  330p  [CAP0603]
C1005  330p  [CAP0603]
C1006  330p  [CAP0603]
C1007  330p  [CAP0603]
FB1001  BLM18KN102EH1D  [RES0603]
J1001  5001  [FP-5001-MFG]
J1002  5001  [FP-5001-MFG]
J1003  5001  [FP-5001-MFG]
J1004  5001  [FP-5001-MFG]
R1001  50  [RES0603]
R1002  50  [RES0603]
R1003  50  [RES0603]
R1004  50  [RES0603]
R1005  50  [RES0603]
R1006  50  [RES0603]
U1001  LTC6262ITS8  [TSOP65P280X100-8N]  (parts A,B of 2)

### Ports
+5-ISO (see full_bridge[2C], full_bridge[1B], isolator[4B], measurements[1B], OV_OC[1B], power_supply[3B]), GND-ISO (see full_bridge[3C], full_bridge[1B], input_filter[2C], isolator[4B], measurements[1B], output_filter[1B], OV_OC[1B], power_supply[3B], voltage_sense[1A]), TP_IN_1 (in, see full_bridge[2C]), TP_IN_2 (in, see full_bridge[2C])

### Nets
+5_ISO: FB1001.1 ; port +5-ISO
ISO_GND: C1001.2 C1002.2 C1003.2 C1005.2 C1006.2 J1002.1 J1004.1 U1001.4(-V) ; port GND-ISO
Out1: C1004.1 J1001.1 U1001.1(OUTA) U1001.2(-INA)
Out2: C1007.1 J1003.1 U1001.6(-INB) U1001.7(OUTB)
SKFeed1: C1004.2 R1002.1 R1003.2
SKFeed2: C1007.2 R1005.1 R1006.2
SKInPos1: C1003.1 R1003.1 U1001.3(+INB)
SKInPos2: C1006.1 R1006.1 U1001.5(+INB)
TP_IN_1: R1001.2 ; port TP_IN_1
TP_IN_2: R1004.2 ; port TP_IN_2
NetC1001_1: C1001.1 FB1001.2 U1001.8(+V)
NetC1002_1: C1002.1 R1001.1 R1002.2
NetC1005_1: C1005.1 R1004.1 R1005.2

### Channels
H-bridge/Choke voltage: designators end in A; ports +5-ISO=+5_ISO GND-ISO=ISO_GND TP_IN_1=TP2 TP_IN_2=TP1
PWM isolation/PWM1and2: designators end in B; ports +5-ISO=+5_ISO GND-ISO=ISO_GND TP_IN_1=ISO_PWM4 TP_IN_2=ISO_PWM3
PWM isolation/PWM3and4: designators end in C; ports +5-ISO=+5_ISO GND-ISO=ISO_GND TP_IN_1=ISO_PWM2 TP_IN_2=ISO_PWM1

### Notes on the sheet
- Nazwa projektu
- Nazwa dokumentu
- Nazwa firmy:
- Autor:
- Osoba sprawdzająca:
- Data:

### Library data of the parts
C1001-C1007 = Capacitor: Value: *; HelpURL: *; MPN: *; Supplier: *; SupplierPartNumber: *
  C1001: Supplier 1: Mouser; Supplier Part Number 1: 581-06035C104KAT2A
FB1001 = Ferrite Bead: Value: *; HelpURL: *; MPN: *; Supplier: *; SupplierPartNumber: *; Supplier 1: Mouser; Supplier Part Number 1: 81-BLM18KN102EH1D
J1001-J1004 = 5001: PC TEST POINT MINIATURE BLACK; Body Material: Bronze; Plating: Silver; Inside Diameter: 1.27mm; Hole Diameter: 1.6mm; Number of Ports: 1; Outside Diameter: 2.54mm; Insulation: Insulated; Insulation Material: Nylon; Mount: Through Hole; RoHS Compliant: Yes; Series: THM; Height: 0.3inch; Termination: Through Hole; Material: Nylon; Packaging: Bulk; Contact Material: Bronze; REACH SVHC: No SVHC; Contact Plating: Silver; Orientation: Straight; Lead Free: Lead Free; Package Quantity: 100; Length: 7.62mm; Flammability Rating: UL94 V-0; Number of Contacts: 1; Diameter: 2.54mm; Housing Color: Black; Color: Black; Supplier 1: Mouser; Supplier Part Number 1: 534-5001
R1001-R1006 = Resistor: Value: *; HelpURL: *; MPN: *; Supplier: *; SupplierPartNumber: *
U1001 = LTC6262ITS8: Op Amps 2x 30MHz, 240 A Pwr Eff R2R I/O Op Amps; Value: *; HelpURL: *; MPN: *; Supplier: *; SupplierPartNumber: *; Supplier 1: Mouser; Supplier Part Number 1: 584-C6262ITS8TRMPBF

## Sheet choke_current_meas.SchDoc
size A4; Date: 04.12.2023; ApprovedBy: Cezary Worek; Author: Mikołaj Pichita; CompanyName: AGH University of Science and Technology; SheetNumber: 7; SheetTotal: 16
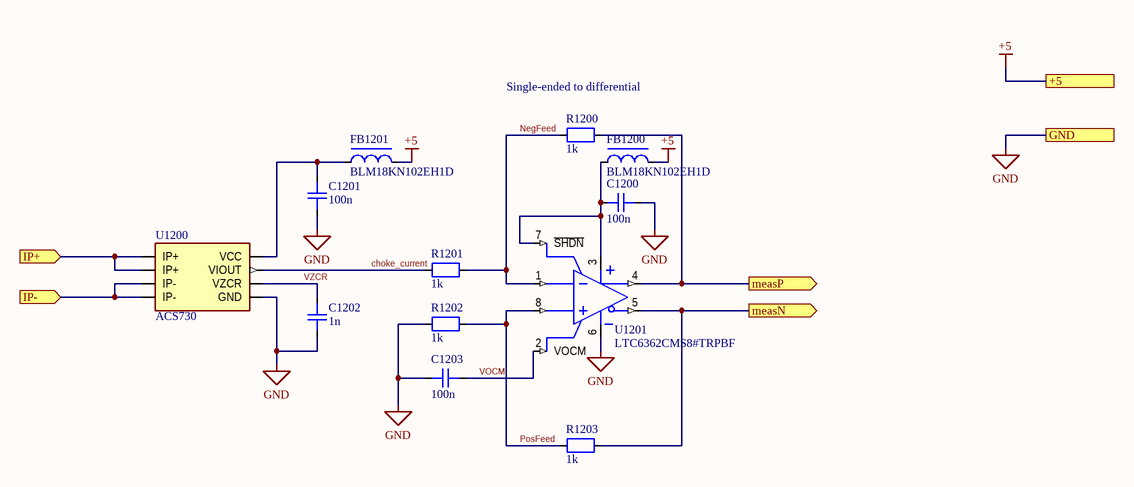
[diagram p8: choke_current_meas.SchDoc]

### Parts
C1200  100n  [CAP0603]
C1201  100n  [CAP0603]
C1202  1n  [CAP0603]
C1203  100n  [CAP0603]
FB1200  BLM18KN102EH1D  [RES0603]
FB1201  BLM18KN102EH1D  [RES0603]
R1200  1k  [RES0603]
R1201  1k  [RES0603]
R1202  1k  [RES0603]
R1203  1k  [RES0603]
U1200  ACS730  [SOIC127P600X175-8N]
U1201  LTC6362CMS8#TRPBF  [LT-MS8-8_M]

### Ports
+5 (see full_bridge[3D], current_sense_shunt[4A], full_bridge[1C], isolator[1B], measurements[1C], microcontroller[1C], power_supply[2B], voltage_sense[4A]), GND (see full_bridge[3D], current_sense_shunt[4A], full_bridge[1D], isolator[1B], measurements[1C], microcontroller[1C], power_supply[1B], voltage_sense[4B]), IP+ (in, see full_bridge[3D]), IP- (in, see full_bridge[3D]), measN (out, see full_bridge[2D]), measP (out, see full_bridge[2D])

### Nets
+5: FB1200.2 FB1201.2 ; port +5
GND: C1200.1 C1201.1 C1202.1 C1203.2 R1202.2 U1200.5(GND) U1201.6(V-) ; port GND
Choke+: U1200.1(IP+) U1200.2(IP+) ; port IP+
Choke-: U1200.3(IP-) U1200.4(IP-) ; port IP-
choke_current: R1201.2 U1200.7(VIOUT)
ChokeCurrent_N: R1203.1 U1201.5(-OUT) ; port measN
ChokeCurrent_P: R1200.1 U1201.4(+OUT) ; port measP
NegFeed: R1200.2 R1201.1 U1201.1(-IN)
PosFeed: R1202.1 R1203.2 U1201.8(+IN)
VOCM: C1203.1 U1201.2(VOCM)
VZCR: C1202.2 U1200.6(VZCR)
NetC1200_2: C1200.2 FB1200.1 U1201.3(V+) U1201.7(~{SHDN})
NetC1201_2: C1201.2 FB1201.1 U1200.8(VCC)

### Notes on the sheet
- (near R1200) Single-ended to differential
- Nazwa projektu
- Nazwa dokumentu
- Nazwa firmy:
- Autor:
- Osoba sprawdzająca:
- Data:

### Library data of the parts
C1200-C1203 = Capacitor: Value: *; HelpURL: *; MPN: *; Supplier: *; SupplierPartNumber: *; Supplier 1: Mouser
  C1200 C1201 C1203: Supplier Part Number 1: 581-06035C104KAT2A
  C1202: Supplier Part Number 1: 581-0603YC102J4T2A
FB1200 FB1201 = Ferrite Bead: Value: *; HelpURL: *; MPN: *; Supplier: *; SupplierPartNumber: *; Supplier 1: Mouser; Supplier Part Number 1: 81-BLM18KN102EH1D
R1200-R1203 = Resistor: Value: *; HelpURL: *; MPN: *; Supplier: *; SupplierPartNumber: *; Supplier 1: Mouser; Supplier Part Number 1: 652-CR0603FX-1001ELF
U1200 = ACS730: 1 MHz Bandwidth, Galvanically Isolated Current Sensor IC in Small Footprint SOIC8 Package; Value: *; HelpURL: *; MPN: *; Supplier: *; SupplierPartNumber: *; Supplier 1: Mouser; Supplier Part Number 1: 250-730KLCTR20ABT
U1201 = LTC6362: Single Channel, Precision, Low Power Differential Operational Amplifier / SAR ADC Driver, RRIO, 180 MHz Typical GBW, 45 V/us Typical SR, 2.8 to 5.25 V, 8-Pin SOP (MS8-8), Commercial, Pb-Free, Reel; Manufacturer: Linear Technology; Vs Max (V): 5.25; GBW (MHz) Typical: 180; Is (mA) Typical: 0.9; SR (V/us) Typical: 45; Vos (mV) Typical: 0.05; Vs Min (V): 2.8; Channels (#): 1; ComponentLink3URL: http://cds.linear.com/docs/en/packaging/05081610_G_SO8.pdf; PartNumber: LTC6362CMS8#TRPBF; ComponentLink2Description: Datasheet; DatasheetVersion: Rev. A; PackageVersion: Rev G; ComponentLink2URL: http://cds.linear.com/docs/en/datasheet/6362fa.pdf; RoHS: Pb-Free; Packing: Reel; Linear Technology Part Number: LTC6362; ComponentLink1URL: http://www.linear.com/; Mounting Technology: Surface Mount; ComponentLink1Description: Manufacturer URL; Type: DIFF; RevisionNote: URLs updated; ComponentLink3Description: Package Specification; PackageReference: LT-MS8-8; PackageDescription: 8-Lead Plastic Small Outline, Body 3.9 x 4.9 mm, Pitch 1.27 mm; Supplier 1: Mouser; Supplier Part Number 1: 584-LTC6362CMS8TRPBF

## Sheet output_filter.SchDoc
size A4; Author: Mikołaj Pichita; CompanyName: AGH University of Science and Technology; SheetNumber: 8; SheetTotal: 16
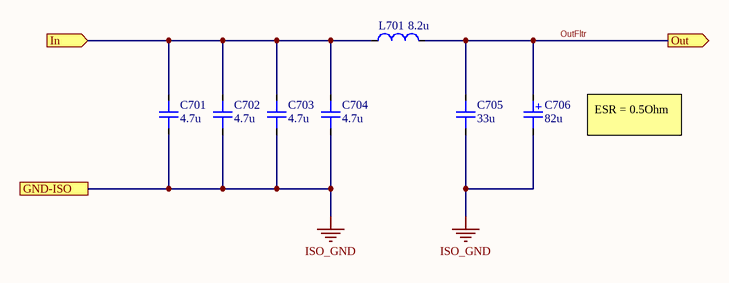
[diagram p9: output_filter.SchDoc]

### Parts
C701  4.7u  [CAP1206]
C702  4.7u  [CAP1206]
C703  4.7u  [CAP1206]
C704  4.7u  [CAP1206]
C705  33u  [CAP2220]
C706  82u  [WCAP-PSLC_D8H11.7]
L701  8.2u  [FP-IHLP-3232DZ-FP_2_413x5-MFG]

### Ports
GND-ISO (see main[3A], full_bridge[1B], input_filter[2C], isolator[4B], measurements[1B], OV_OC[1B], power_supply[3B], testpoint[1A], voltage_sense[1A]), In (in, see main[3A]), Out (out, see main[3A])

### Nets
ISO_GND: C701.2 C702.2 C703.2 C704.2 C705.2 C706.2 ; port GND-ISO
OutFltr: C705.1 C706.1 L701.2 ; port Out
Vout: C701.1 C702.1 C703.1 C704.1 L701.1 ; port In

### Notes on the sheet
- ESR = 0.5Ohm
- Nazwa projektu
- Nazwa dokumentu
- Nazwa firmy:
- Autor:
- Osoba sprawdzająca:
- Data:

### Library data of the parts
C701-C706 = Capacitor: Value: *; HelpURL: *; MPN: *; Supplier: *; SupplierPartNumber: *; Supplier 1: Mouser
  C701-C704: Supplier Part Number 1: 581-12065C475KAT4A
  C705: Supplier Part Number 1: 81-KRM55WR71H336MH1K
  C706: Supplier Part Number 1: 710-875115652006
L701 = Inductor: Value: *; HelpURL: *; MPN: *; Supplier: *; SupplierPartNumber: *; Supplier 1: Mouser; Supplier Part Number 1: 70-IHLP3232DZER8R2M1

## Sheet power_supply.SchDoc
size A4; Author: Mikołaj Pichita; CompanyName: AGH University of Science and Technology; SheetNumber: 9; SheetTotal: 16
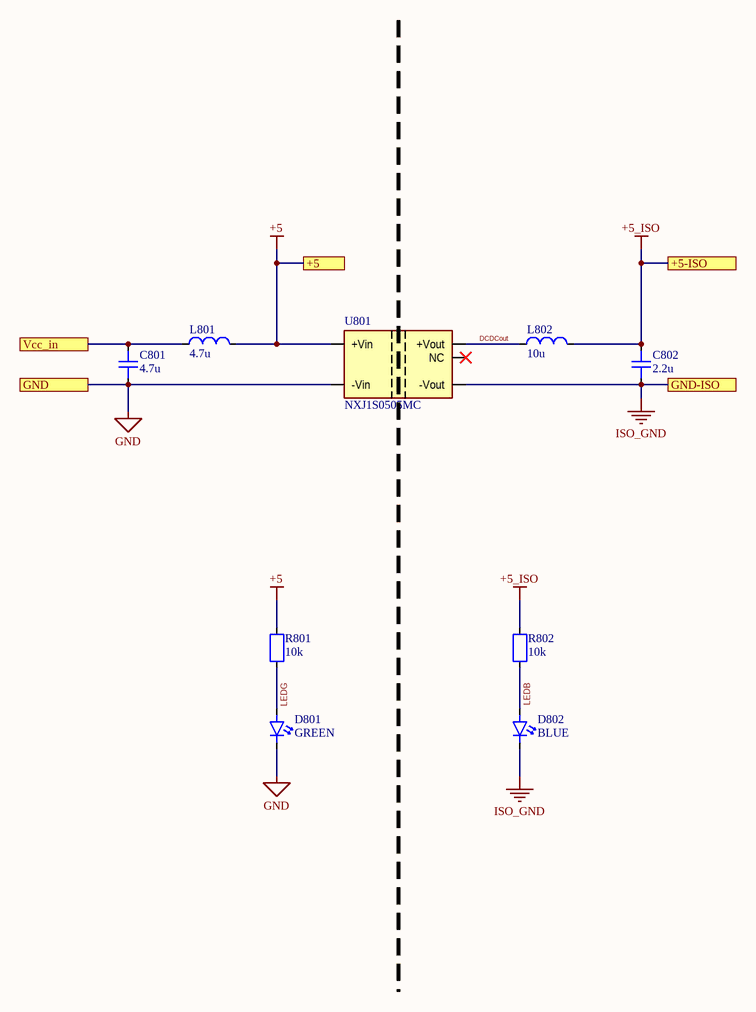
[diagram p10: power_supply.SchDoc]

### Parts
C801  4.7u  [CAP0603]
C802  2.2u  [CAP0603]
D801  GREEN  [LED0603]
D802  BLUE  [LED0603]
L801  4.7u  [FP-8200-MFG]
L802  10u  [FP-8200-MFG]
R801  10k  [RES0603]
R802  10k  [RES0603]
U801  NXJ1S0505MC  [NXJ1]

### Ports
+5 (see main[1B], choke_current_meas[4B], current_sense_shunt[4A], full_bridge[1C], isolator[1B], measurements[1C], microcontroller[1C], voltage_sense[4A]), +5-ISO (see main[1B], full_bridge[1B], isolator[4B], measurements[1B], OV_OC[1B], testpoint[2A]), GND (see main[1B], choke_current_meas[4B], current_sense_shunt[4B], full_bridge[1D], isolator[1B], measurements[1C], microcontroller[1C], voltage_sense[4B]), GND-ISO (see main[1B], full_bridge[1B], input_filter[2C], isolator[4B], measurements[1B], output_filter[1B], OV_OC[1B], testpoint[2A], voltage_sense[1B]), Vcc_in (see main[1B])

### Nets
+5: L801.2 R801.1 U801.3(+Vin) ; port +5
+5_ISO: C802.1 L802.2 R802.1 ; port +5-ISO
GND: C801.2 D801.2 U801.1(-Vin) ; port GND
ISO_GND: C802.2 D802.2 U801.7(-Vout) ; port GND-ISO
VCC: C801.1 L801.1 ; port Vcc_in
DCDCout: L802.1 U801.8(+Vout)
LEDB: D802.1 R802.2
LEDG: D801.1 R801.2

Not connected (* = marked no-connect by the designer): U801 14(NC)*

### Notes on the sheet
- Nazwa projektu
- Nazwa dokumentu
- Nazwa firmy:
- Autor:
- Osoba sprawdzająca:
- Data:

### Library data of the parts
C801 C802 = Capacitor: Value: *; HelpURL: *; MPN: *; Supplier: *; SupplierPartNumber: *; Supplier 1: Mouser; Supplier Part Number 1: 581-06033D475KAT2A
D801 D802 = LED: Value: *; HelpURL: *; MPN: *; Supplier: *; SupplierPartNumber: *; Supplier 1: Mouser
  D801: Supplier Part Number 1: 604-APTD1608LZGCK
  D802: Supplier Part Number 1: 604-APTD1608LVBCD
L801 L802 = Inductor: Value: *; HelpURL: *; MPN: *; Supplier: *; SupplierPartNumber: *; Supplier 1: Mouser
  L801: Supplier Part Number 1: 580-82472C
  L802: Supplier Part Number 1: 580-82103C
R801 R802 = Resistor: Value: *; HelpURL: *; MPN: *; Supplier: *; SupplierPartNumber: *; Supplier 1: Mouser; Supplier Part Number 1: 603-RT0603DRE0716K5L
U801 = NXJ1S0505MC: Isolated DC/DC Converters - SMD SM 1W 5V-5V SINGLE 4.2KV; Value: *; HelpURL: *; MPN: *; Supplier: *; SupplierPartNumber: *; Supplier 1: Mouser; Supplier Part Number 1: 580-NXJ1S0505MC-R13

## Sheet isolator.SchDoc
size A4; Author: Mikołaj Pichita; CompanyName: AGH University of Science and Technology; SheetNumber: 10; SheetTotal: 16
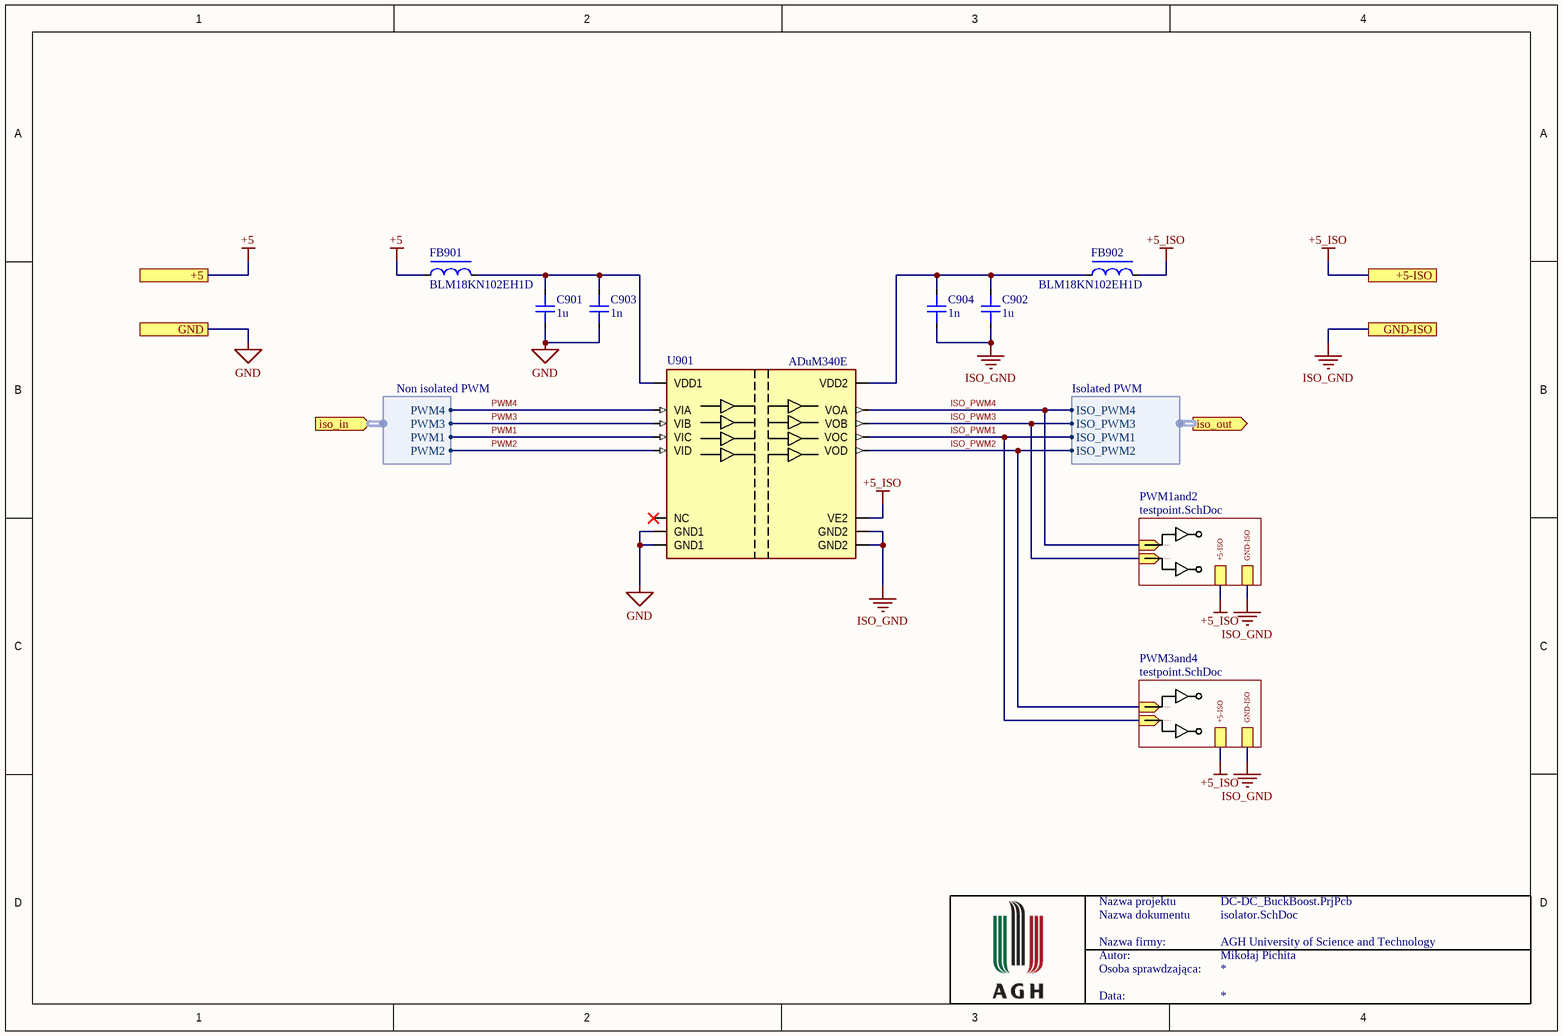
[diagram p11: isolator.SchDoc]

### Parts
C901  1u  [CAP0603]
C902  1u  [CAP0603]
C903  1n  [CAP0603]
C904  1n  [CAP0603]
FB901  BLM18KN102EH1D  [RES0603]
FB902  BLM18KN102EH1D  [RES0603]
U901  ADuM340E  [SOIC127P1030X265-16N]

### Sub-sheets
PWM1and2 = testpoint.SchDoc: TP_IN_1 (in), TP_IN_2 (in), +5-ISO, GND-ISO
PWM3and4 = testpoint.SchDoc: TP_IN_1 (in), TP_IN_2 (in), +5-ISO, GND-ISO

### Ports
+5 (see main[3B], choke_current_meas[4B], current_sense_shunt[4A], full_bridge[1C], measurements[1C], microcontroller[1C], power_supply[2B], voltage_sense[4A]), +5-ISO (see main[3B], full_bridge[1B], measurements[1B], OV_OC[1B], power_supply[3B], testpoint[2A]), GND (see main[3B], choke_current_meas[4B], current_sense_shunt[4B], full_bridge[1D], measurements[1C], microcontroller[1C], power_supply[1B], voltage_sense[4B]), GND-ISO (see main[3B], full_bridge[1B], input_filter[2C], measurements[1B], output_filter[1B], OV_OC[1B], power_supply[3B], testpoint[2A], voltage_sense[1B]), iso_in (in, harness Non isolated PWM, see main[3B]), iso_out (out, harness Isolated PWM, see main[3B])

### Harnesses
Isolated PWM: ISO_PWM4, ISO_PWM1, ISO_PWM2, ISO_PWM3
Non isolated PWM: PWM1, PWM2, PWM3, PWM4

### Nets
+5: FB901.2 ; port +5
+5_ISO: FB902.1 U901.10(VE2) ; port +5-ISO, sheet PWM1and2/+5-ISO, sheet PWM3and4/+5-ISO
GND: C901.1 C903.2 U901.2(GND1) U901.8(GND1) ; port GND
ISO_GND: C902.1 C904.2 U901.9(GND2) U901.15(GND2) ; port GND-ISO, sheet PWM1and2/GND-ISO, sheet PWM3and4/GND-ISO
ISO_PWM1: U901.12(VOC) ; sheet PWM3and4/TP_IN_2, port iso_out.ISO_PWM1
ISO_PWM2: U901.11(VOD) ; sheet PWM3and4/TP_IN_1, port iso_out.ISO_PWM2
ISO_PWM3: U901.13(VOB) ; sheet PWM1and2/TP_IN_2, port iso_out.ISO_PWM3
ISO_PWM4: U901.14(VOA) ; sheet PWM1and2/TP_IN_1, port iso_out.ISO_PWM4
PWM1: U901.5(VIC) ; port iso_in.PWM1
PWM2: U901.6(VID) ; port iso_in.PWM2
PWM3: U901.4(VIB) ; port iso_in.PWM3
PWM4: U901.3(VIA) ; port iso_in.PWM4
NetC901_2: C901.2 C903.1 FB901.1 U901.1(VDD1)
NetC902_2: C902.2 C904.1 FB902.2 U901.16(VDD2)

Not connected (* = marked no-connect by the designer): U901 7(NC)*

### Notes on the sheet
- Nazwa projektu
- Nazwa dokumentu
- Nazwa firmy:
- Autor:
- Osoba sprawdzająca:
- Data:

### Library data of the parts
C901-C904 = Capacitor: Value: *; HelpURL: *; MPN: *; Supplier: *; SupplierPartNumber: *; Supplier 1: Mouser
  C901 C902: Supplier Part Number 1: 77-VJ0603Y333KXJAC
  C903 C904: Supplier Part Number 1: 581-0603YC102J4T2A
FB901 FB902 = Ferrite Bead: Value: *; HelpURL: *; MPN: *; Supplier: *; SupplierPartNumber: *; Supplier 1: Mouser; Supplier Part Number 1: 81-BLM18KN102EH1D
U901 = ADuM340E: 5.7 kV rms Quad Digital Isolators; Value: *; HelpURL: *; MPN: *; Supplier: *; SupplierPartNumber: *

## Sheet microcontroller.SchDoc
size A4; Author: Mikołaj Pichita; CompanyName: AGH University of Science and Technology; SheetNumber: 11; SheetTotal: 16
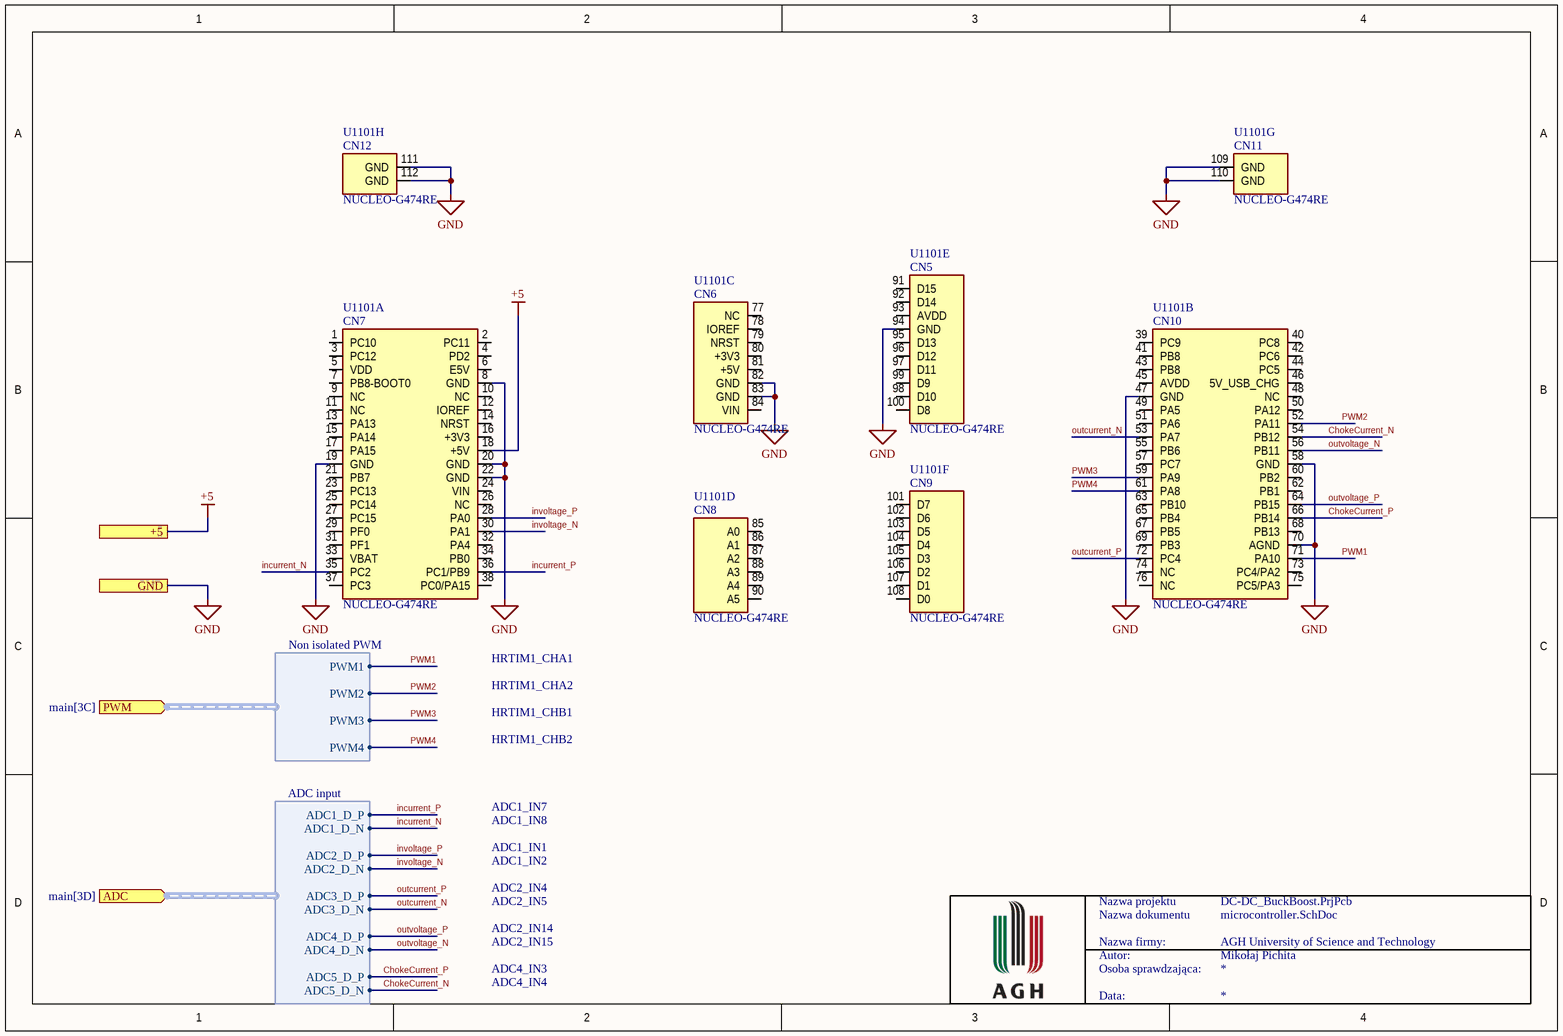
[diagram p12: microcontroller.SchDoc]

### Parts
U1101  NUCLEO-G474RE  [G474RE]  (parts A,B,C,D,E,F,G,H of 8)

### Ports
+5 (see main[2D], choke_current_meas[4B], current_sense_shunt[4A], full_bridge[1C], isolator[1B], measurements[1C], power_supply[2B], voltage_sense[4A]), ADC (in, harness ADC input, see main[3D]), GND (see main[2D], choke_current_meas[4B], current_sense_shunt[4A], full_bridge[1D], isolator[1B], measurements[1C], power_supply[1B], voltage_sense[4A]), PWM (in, harness Non isolated PWM, see main[3C])

### Harnesses
Non isolated PWM: PWM1, PWM2, PWM3, PWM4
ADC input: ADC5_D_P, ADC1_D_N, ADC2_D_N, ADC3_D_N, ADC4_D_N, ADC1_D_P, ADC2_D_P, ADC3_D_P, ADC4_D_P, ADC5_D_N

### Nets
+5: U1101.18(+5V) ; port +5
GND: U1101.8(GND) U1101.19(GND) U1101.20(GND) U1101.22(GND) U1101.47(GND) U1101.58(GND) U1101.70(AGND) U1101.82(GND) U1101.83(GND) U1101.94(GND) U1101.109(GND) U1101.110(GND) U1101.111(GND) U1101.112(GND) ; port GND
ChokeCurrent_N: U1101.54(PB12) ; port ADC.ADC5_D_N
ChokeCurrent_P: U1101.66(PB14) ; port ADC.ADC5_D_P
incurrent_N: U1101.35(PC2) ; port ADC.ADC1_D_N
incurrent_P: U1101.36(PC1/PB9) ; port ADC.ADC1_D_P
involtage_N: U1101.30(PA1) ; port ADC.ADC2_D_N
involtage_P: U1101.28(PA0) ; port ADC.ADC2_D_P
outcurrent_N: U1101.53(PA7) ; port ADC.ADC3_D_N
outcurrent_P: U1101.72(PC4) ; port ADC.ADC3_D_P
outvoltage_N: U1101.56(PB11) ; port ADC.ADC4_D_N
outvoltage_P: U1101.64(PB15) ; port ADC.ADC4_D_P
PWM1: U1101.71(PA10) ; port PWM.PWM1
PWM2: U1101.52(PA11) ; port PWM.PWM2
PWM3: U1101.59(PA9) ; port PWM.PWM3
PWM4: U1101.61(PA8) ; port PWM.PWM4

Not connected (* = marked no-connect by the designer): U1101 1(PC10) 2(PC11) 3(PC12) 4(PD2) 5(VDD) 6(E5V) 7(PB8-BOOT0) 9(NC) 10(NC) 11(NC) 12(IOREF) 13(PA13) 14(NRST) 15(PA14) 16(+3V3) 17(PA15) 21(PB7) 23(PC13) 24(VIN) 25(PC14) 26(NC) 27(PC15) 29(PF0) 31(PF1) 32(PA4) 33(VBAT) 34(PB0) 37(PC3) 38(PC0/PA15) 39(PC9) 40(PC8) 41(PB8) 42(PC6) 43(PB8) 44(PC5) 45(AVDD) 46(5V_USB_CHG) 48(NC) 49(PA5) 50(PA12) 51(PA6) 55(PB6) 57(PC7) 60(PB2) 62(PB1) 63(PB10) 65(PB4) 67(PB5) 68(PB13) 69(PB3) 73(PC4/PA2) 74(NC) 75(PC5/PA3) 76(NC) 77(NC) 78(IOREF) 79(NRST) 80(+3V3) 81(+5V) 84(VIN) 85(A0) 86(A1) 87(A2) 88(A3) 89(A4) 90(A5) 91(D15) 92(D14) 93(AVDD) 95(D13) 96(D12) 97(D11) 98(D10) 99(D9) 100(D8) 101(D7) 102(D6) 103(D5) 104(D4) 105(D3) 106(D2) 107(D1) 108(D0)

### Notes on the sheet
- HRTIM1_CHA1
- HRTIM1_CHA2
- HRTIM1_CHB1
- HRTIM1_CHB2
- ADC1_IN1
- ADC1_IN7
- ADC1_IN8
- ADC1_IN2
- ADC2_IN5
- ADC2_IN4
- ADC2_IN14
- ADC2_IN15
- ADC4_IN3
- ADC4_IN4
- Nazwa projektu
- Nazwa dokumentu
- Nazwa firmy:
- Autor:
- Osoba sprawdzająca:
- Data:
- (in symbol NUCLEO-G474RE, part A) CN7
- (in symbol NUCLEO-G474RE, part B) CN10
- (in symbol NUCLEO-G474RE, part C) CN6
- (in symbol NUCLEO-G474RE, part D) CN8
- (in symbol NUCLEO-G474RE, part E) CN5
- (in symbol NUCLEO-G474RE, part F) CN9
- (in symbol NUCLEO-G474RE, part G) CN11
- (in symbol NUCLEO-G474RE, part H) CN12

### Library data of the parts
U1101 = NUCLEO-G474RE: STM32 Nucleo-64 development board with STM32G474RE MCU, supports Arduino and ST morpho connectivity; Value: *; HelpURL: *; MPN: *; Supplier: *; SupplierPartNumber: *

## Sheet EMI_filter.SchDoc
size A4; Author: Mikołaj Pichita; CompanyName: AGH University of Science and Technology; SheetNumber: 3; SheetTotal: 16
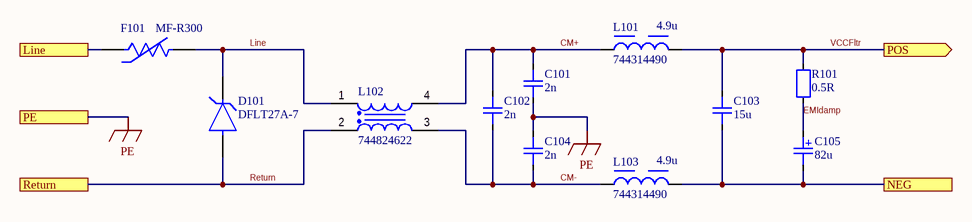
[diagram p13: EMI_filter.SchDoc]

### Parts
C101  2n  [CAP0603]
C102  2n  [CAP0603]
C103  15u  [CAP2220]
C104  2n  [CAP0603]
C105  82u  [WCAP-PSLC_D8H11.7]
D101  DFLT27A-7  [FP-PowerDI123-MFG]
F101  MF-R300  [FP-MF-R300-MFG]
L101  744314490  [WE-HCI_7050]
L102  744824622  [WE-CMB_Type L_L27.5W18.5H33]
L103  744314490  [WE-HCI_7050]
R101  0.5R  [RES0603]

### Ports
Line (see main[1A]), NEG (see main[1A]), PE (see main[1A]), POS (out, see main[1A]), Return (see main[1A])

### Nets
ISO_GND: C103.2 C105.2 L103.2 ; port NEG
PE: C101.2 C104.1 ; port PE
V_IN: F101.1 ; port Line
CM+: C101.1 C102.1 L101.1 L102.4
CM-: C102.2 C104.2 L102.3 L103.1
EMIdamp: C105.1 R101.2
Line: D101.1(C) F101.2 L102.1
Return: D101.2(A) L102.2 ; port Return
VCCFltr: C103.1 L101.2 R101.1 ; port POS

### Notes on the sheet
- (near L101) 4.9u
- (near L103) 4.9u
- Nazwa projektu
- Nazwa dokumentu
- Nazwa firmy:
- Autor:
- Osoba sprawdzająca:
- Data:

### Library data of the parts
C101-C105 = Capacitor: Value: *; HelpURL: *; MPN: *; Supplier: *; SupplierPartNumber: *; Supplier 1: Mouser
  C101 C102 C104: Supplier Part Number 1: 80-C0603C202J2G
  C103: Supplier Part Number 1: 810-C5750X7S2A156M
  C105: Supplier Part Number 1: 710-875115652006
D101 = CMP-12828-000010-1: TVS DIODE 27V 43.7V POWERDI 123; Manufacturer: Diodes Inc; Peak Pulse Current: 5.15A; Direction: Unidirectional; Peak Pulse Power: 1125W; Breakdown Voltage: 30V; Number Of Channels: 1; Max Junction Temp: +150°C; Mouser Description: TVS Diodes - Transient Voltage Suppressors TVS UNIDIRECTIONAL; Device Class L1: Circuit Protection; Temperature: -65°C to +150°C; Device Class L3: unset; ComponentLink2URL: https://www.diodes.com/assets/Datasheets/ds30581.pdf; Package: PowerDI123; Reverse Standoff Voltage: 27V; Temperature Range Low: -65°C; RoHS: TRUE; Footprint Url: https://www.diodes.com/assets/Package-Files/PowerDI123.pdf; Category: Diode; Automotive: No; Device Class L2: TVS Diodes; Digikey Description: TVS DIODE 27V 43.7V POWERDI 123; Temperature Range High: +150°C; Octopart: https://octopart.com/dflt27a-7-diodes+inc.-347680; Height: 1mm; ComponentLink2Description: Datasheet; Lead Free: Yes; Manufacturer Part Number: DFLT27A-7; Clamping Voltage: 43.7V
F101 = CMP-07400-000007-1: PTC RESET FUSE 30V 3A RADIAL; Manufacturer: Bourns Inc.; Current Rating: 40A; Trip Current: 6A; Trip Time: 10.8s; Resistance: 0.02-0.08Ω; Value: 0.02-0.08Ω; Temperature Range Low: -40°C; Temperature: -40°C to +85°C; Octopart: https://octopart.com/mf-r300-bourns-15098; Lead Free: Yes; ComponentLink2Description: Datasheet; Height: 18.3mm; Voltage Rating: 30V; Device Class L2: PTC Resettable Fuses; Ambient Temperature Range Low: -40°C; Mouser Description: Resettable Fuses - PPTC 30v Max 40Amps Max Hold 3.0 Trip 6.0; Manufacturer Part Number: MF-R300; Temperature Range High: +85°C; Digikey Description: PTC RESET FUSE 30V 3A RADIAL; Ambient Temperature Range High: +85°C; ComponentLink2URL: https://www.bourns.com/docs/Product-Datasheets/mfr.pdf; Automotive: No; Package: 0; Device Class L1: Circuit Protection; RoHS: TRUE; Category: Fuse; Hold Current: 3A; Device Class L3: unset
L101 L103 = 744314490: NexarPartId: 7864302; Self Resonant Frequency: 56MHz; Max DC Current: 6.5A; Tolerance: 20%; Test Frequency: 100kHz; Inductance: 4.9µH; Shielding: Shielded; Series Resistance: 14.5Ω; DC Resistance (DCR): 14.5mΩ; Case/Package: 7050; Number of Pins: 2; Lead Free: Lead Free; REACH SVHC: Unknown; Mount: Surface Mount; Packaging: Cut Tape (CT); Ambient Temperature Range Low: -40°C; Max Operating Temperature: 150°C; Depth: 7.2mm; Height: 4.8mm; Height - Seated (Max): 5.0038mm; Saturation Current: 6.5A; Military Standard: Not; Composition: Wirewound; Inductance Tolerance: 20%; Ambient Temperature Range High: 100°C; Length: 7mm; RoHS: Compliant; Width: 6.9mm; Resistance: 14.5mΩ; Min Operating Temperature: -40°C; Current Rating: 6.5A; Termination: SMD/SMT; RMS Current (Irms): 6.5A; Supplier 1: Mouser; Supplier Part Number 1: 710-744314490
L102 = 744824622: NexarPartId: 22865134; Inductance Tolerance: 30%; Resistance: 20mΩ; Inductance: 2.2mH; Voltage Rating: 250V; Current Rating: 6A; Pin Length: 5mm; Width: 18.5mm; Ambient Temperature Range Low: -40°C; Min Operating Temperature: -40°C; Ambient Temperature Range High: 70°C; Number of Pins: 4; Packaging: Bulk; Length: 27.5mm; Max Operating Temperature: 125°C; RoHS: Compliant; Height: 33mm; Supplier 1: Mouser; Supplier Part Number 1: 710-744824622
R101 = Resistor: Value: *; HelpURL: *; MPN: *; Supplier: *; SupplierPartNumber: *; Supplier 1: Mouser; Supplier Part Number 1: 71-RCWE0603R500FKEA

## Sheet Drawing.SchDoc
size A4; Author: Mikołaj Pichita; CompanyName: AGH University of Science and Technology; SheetNumber: 16; SheetTotal: 16
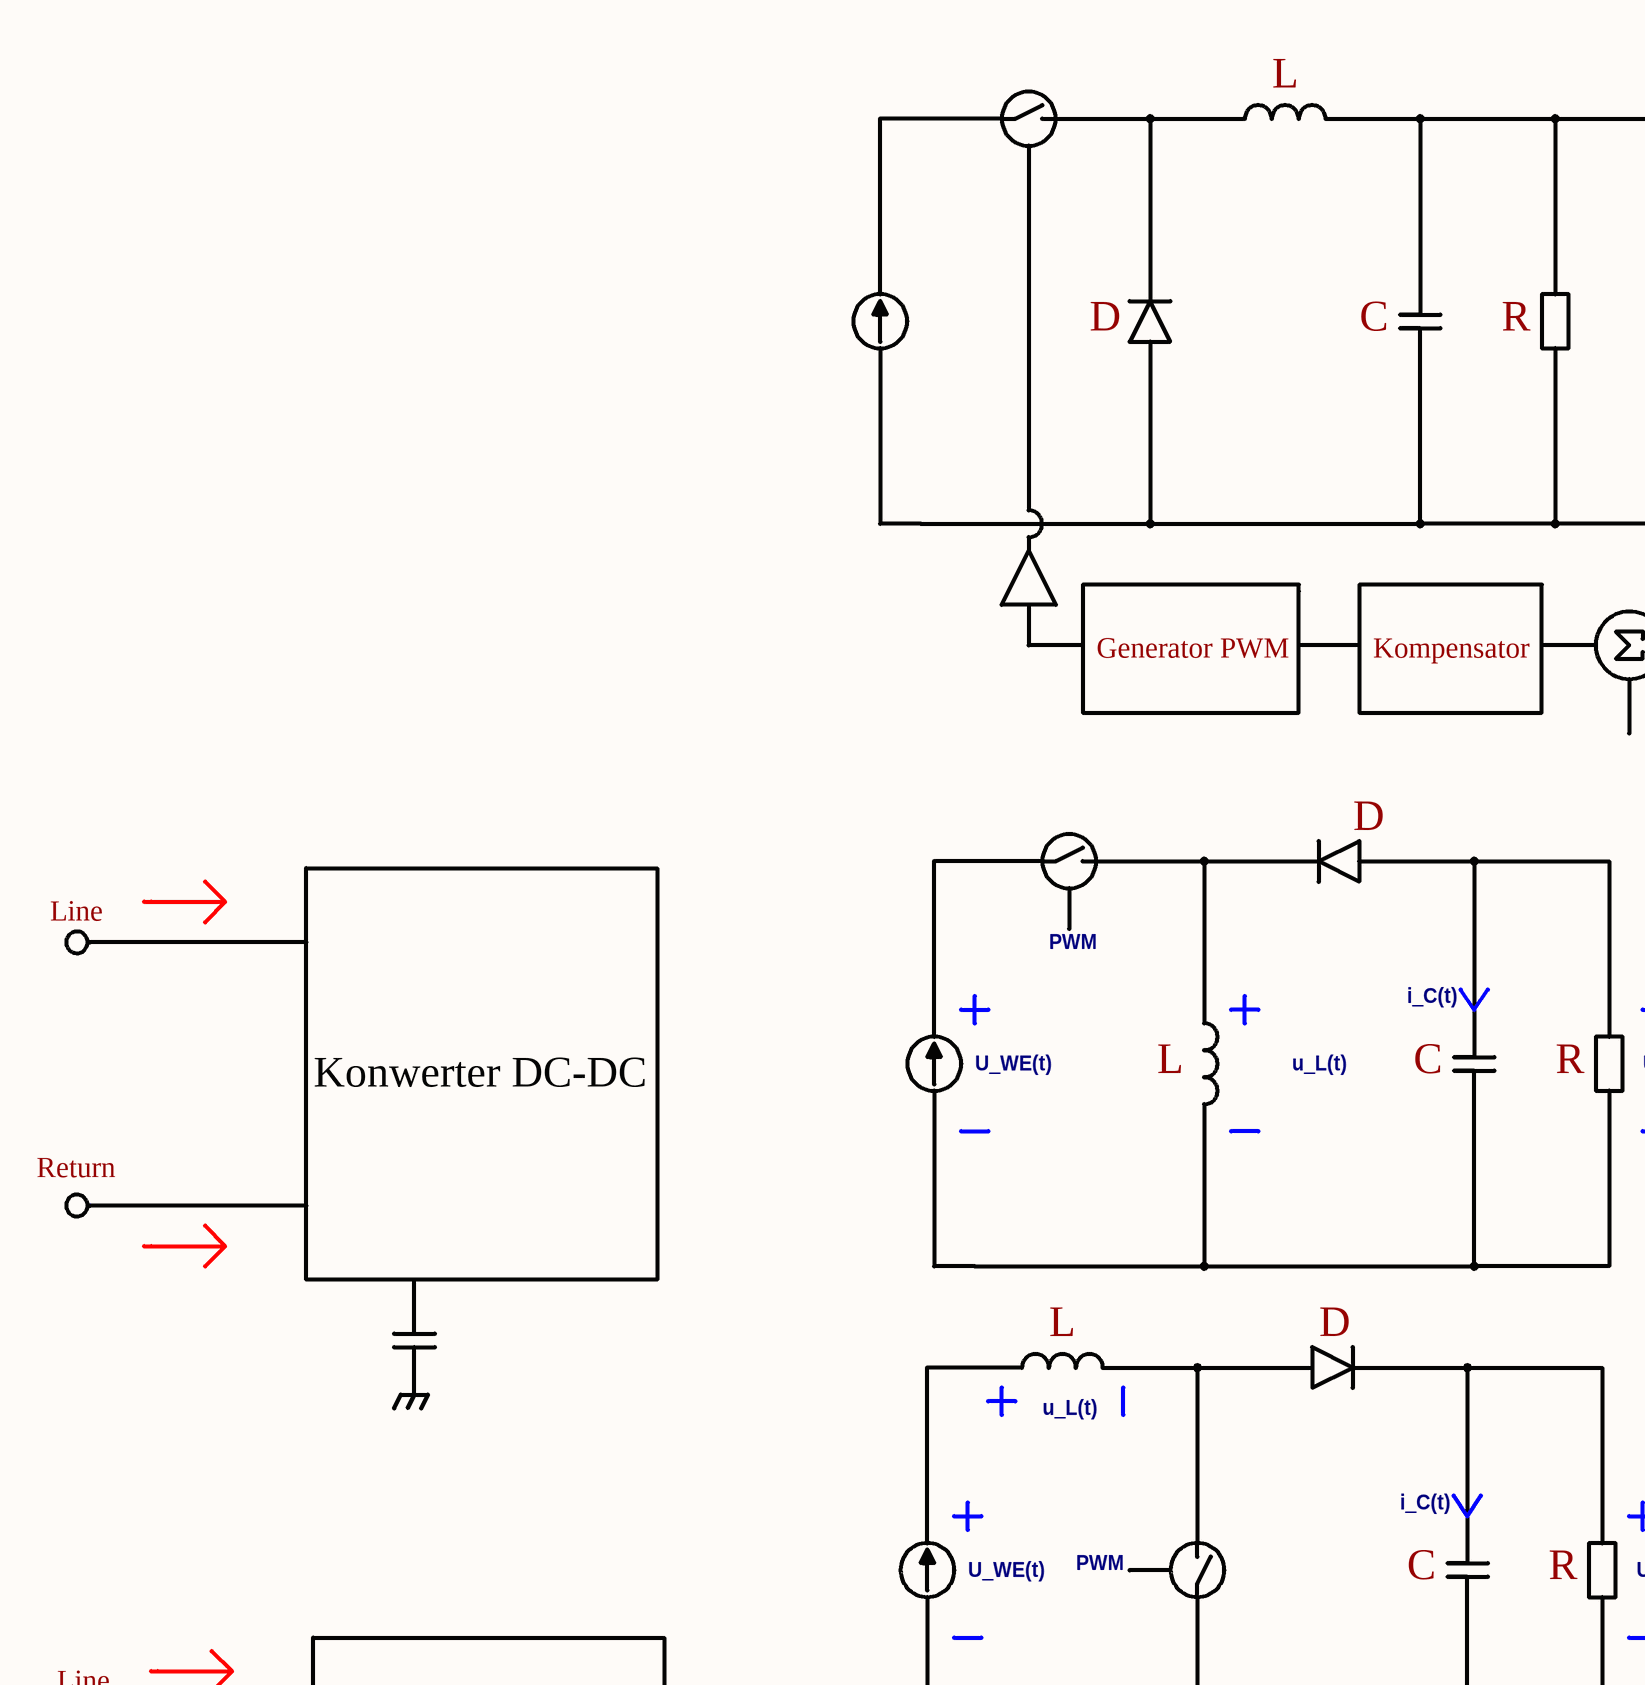
[diagram p14: Drawing.SchDoc, top left]
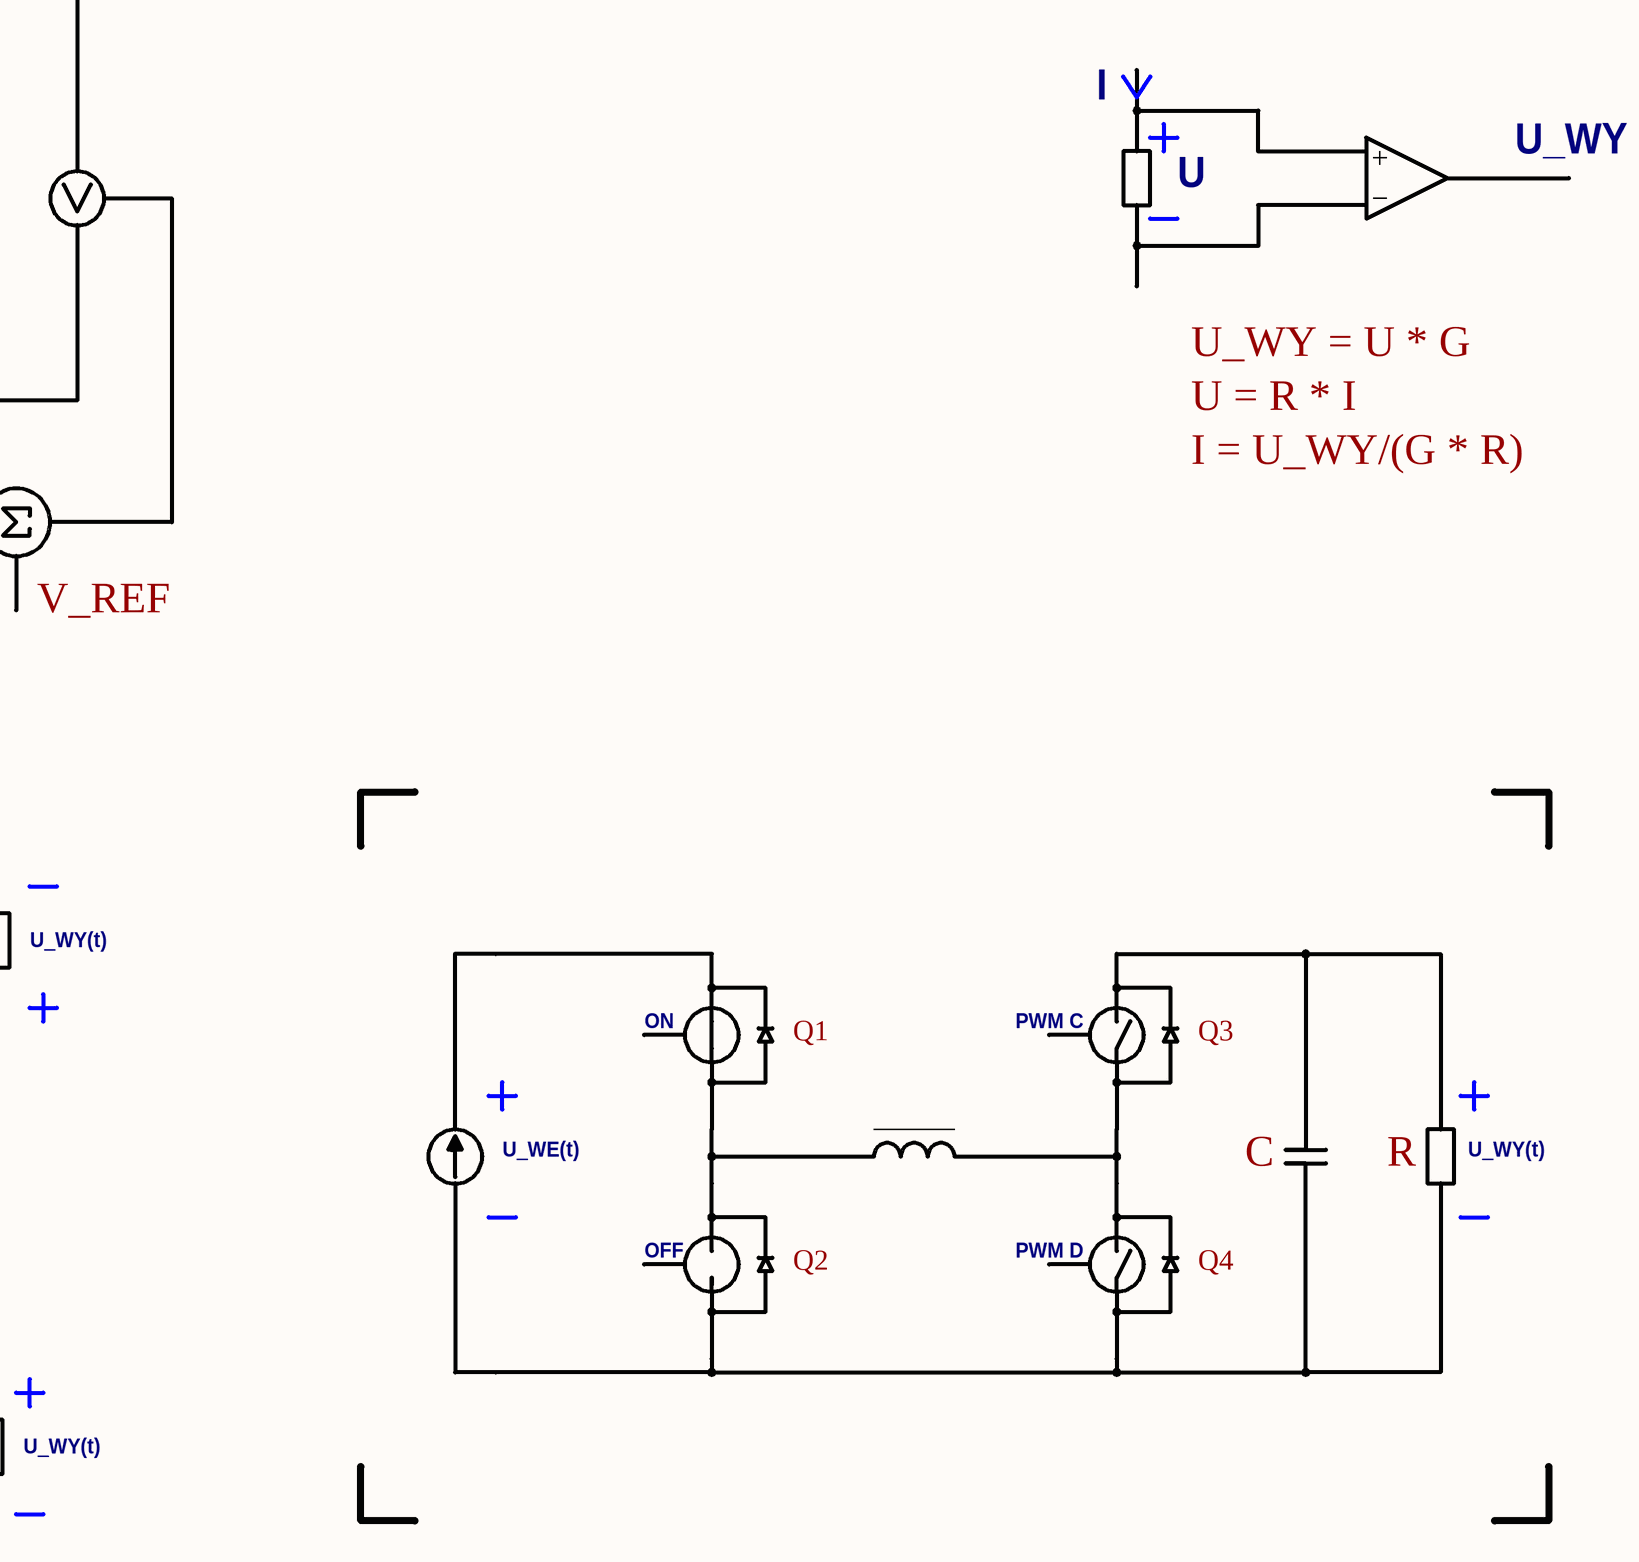
[diagram p15: Drawing.SchDoc, top middle]
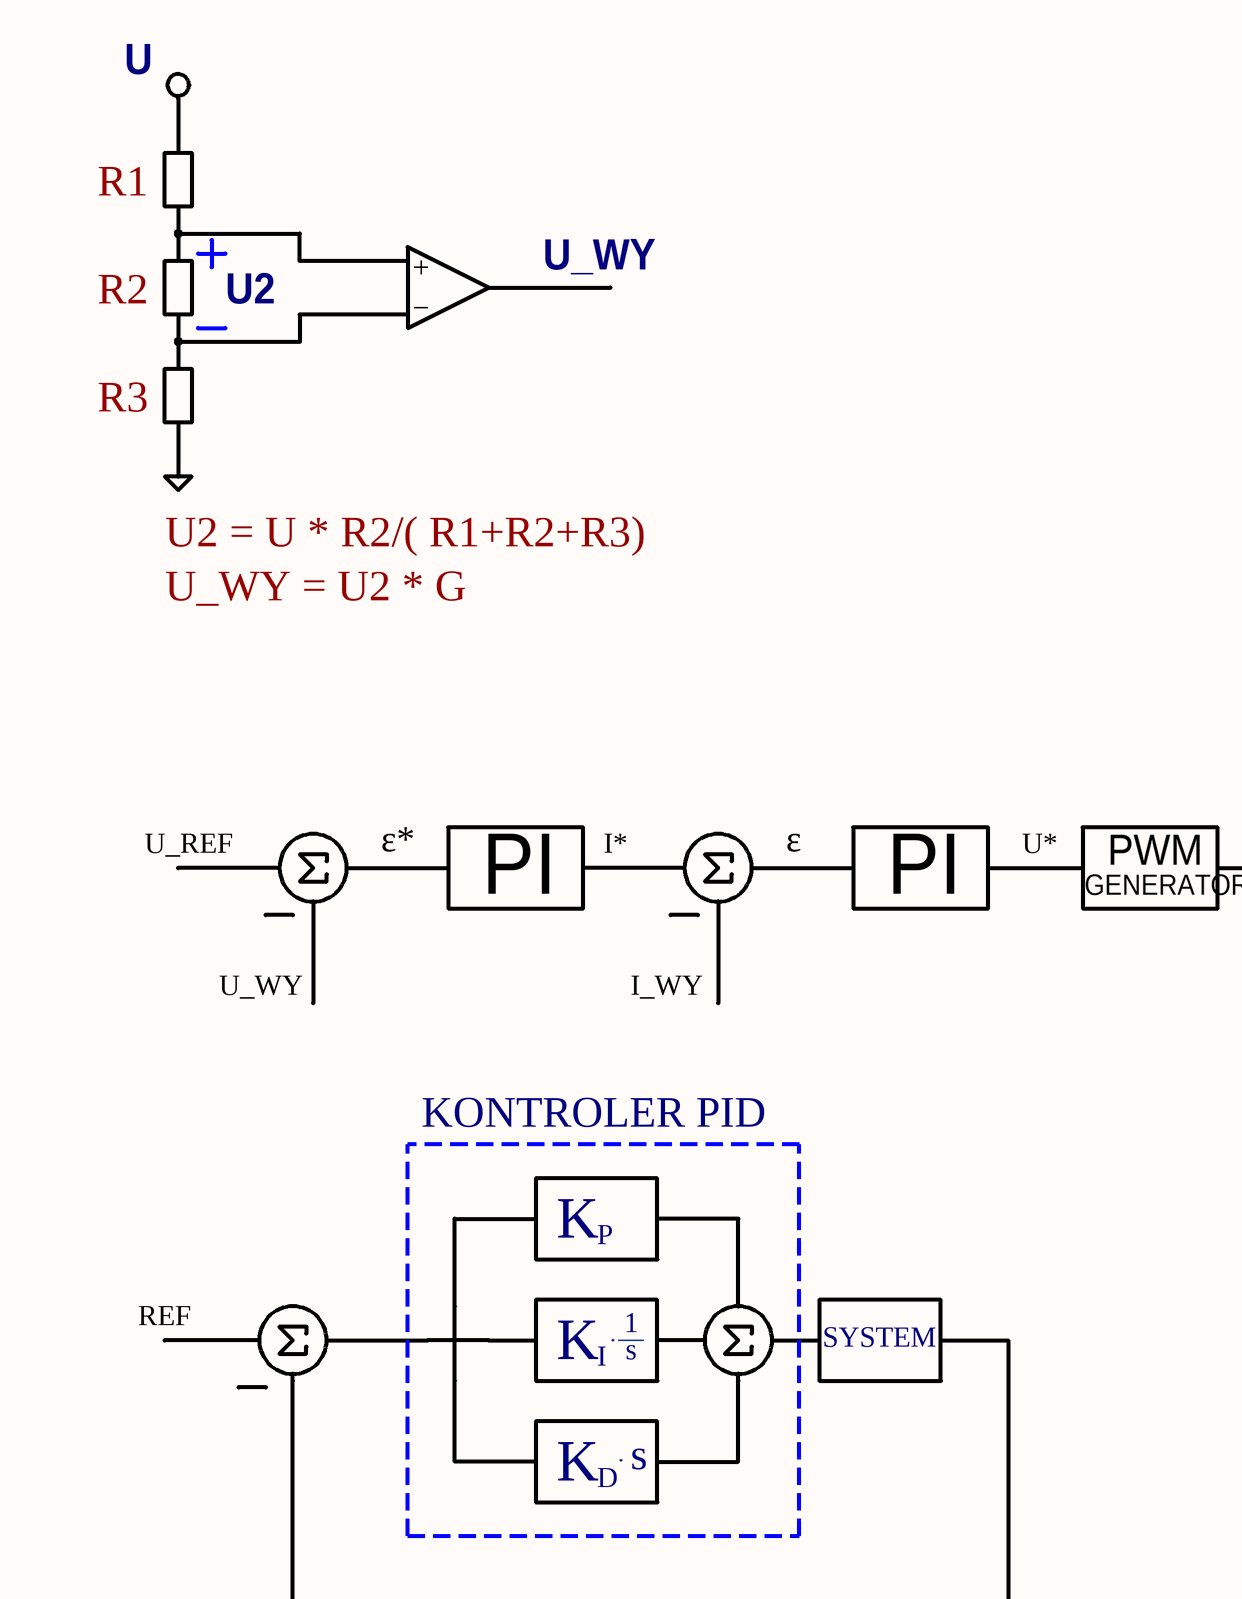
[diagram p16: Drawing.SchDoc, top right]
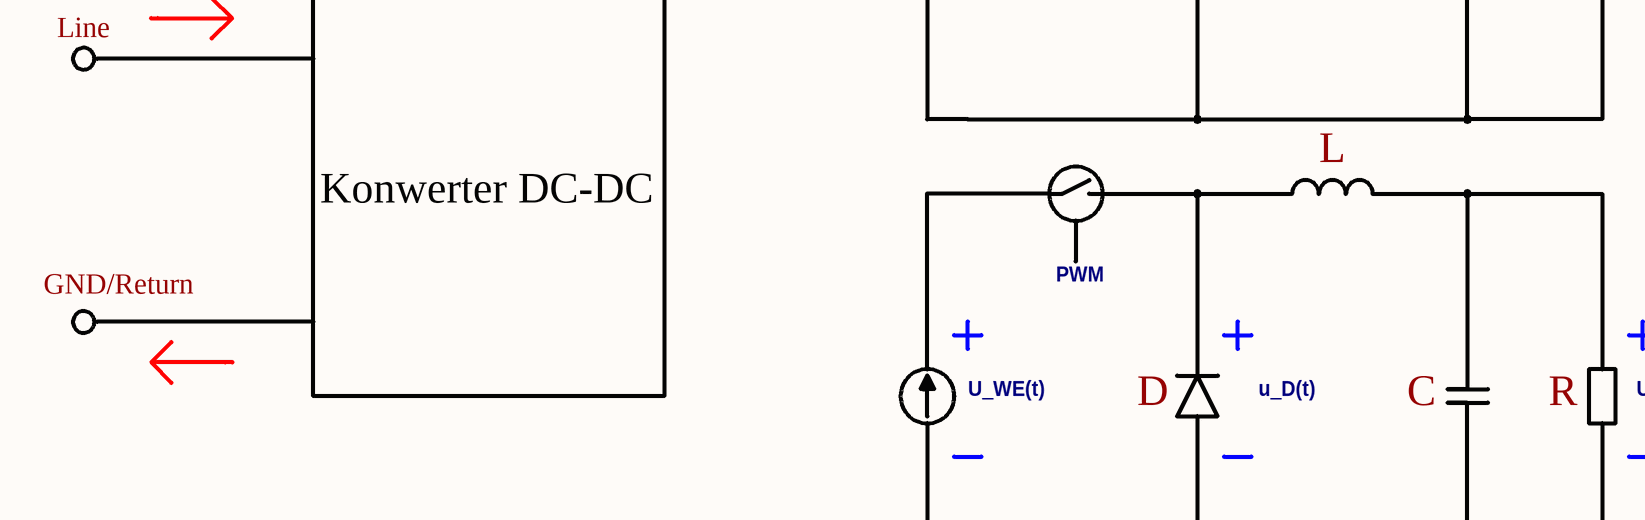
[diagram p17: Drawing.SchDoc, bottom left]
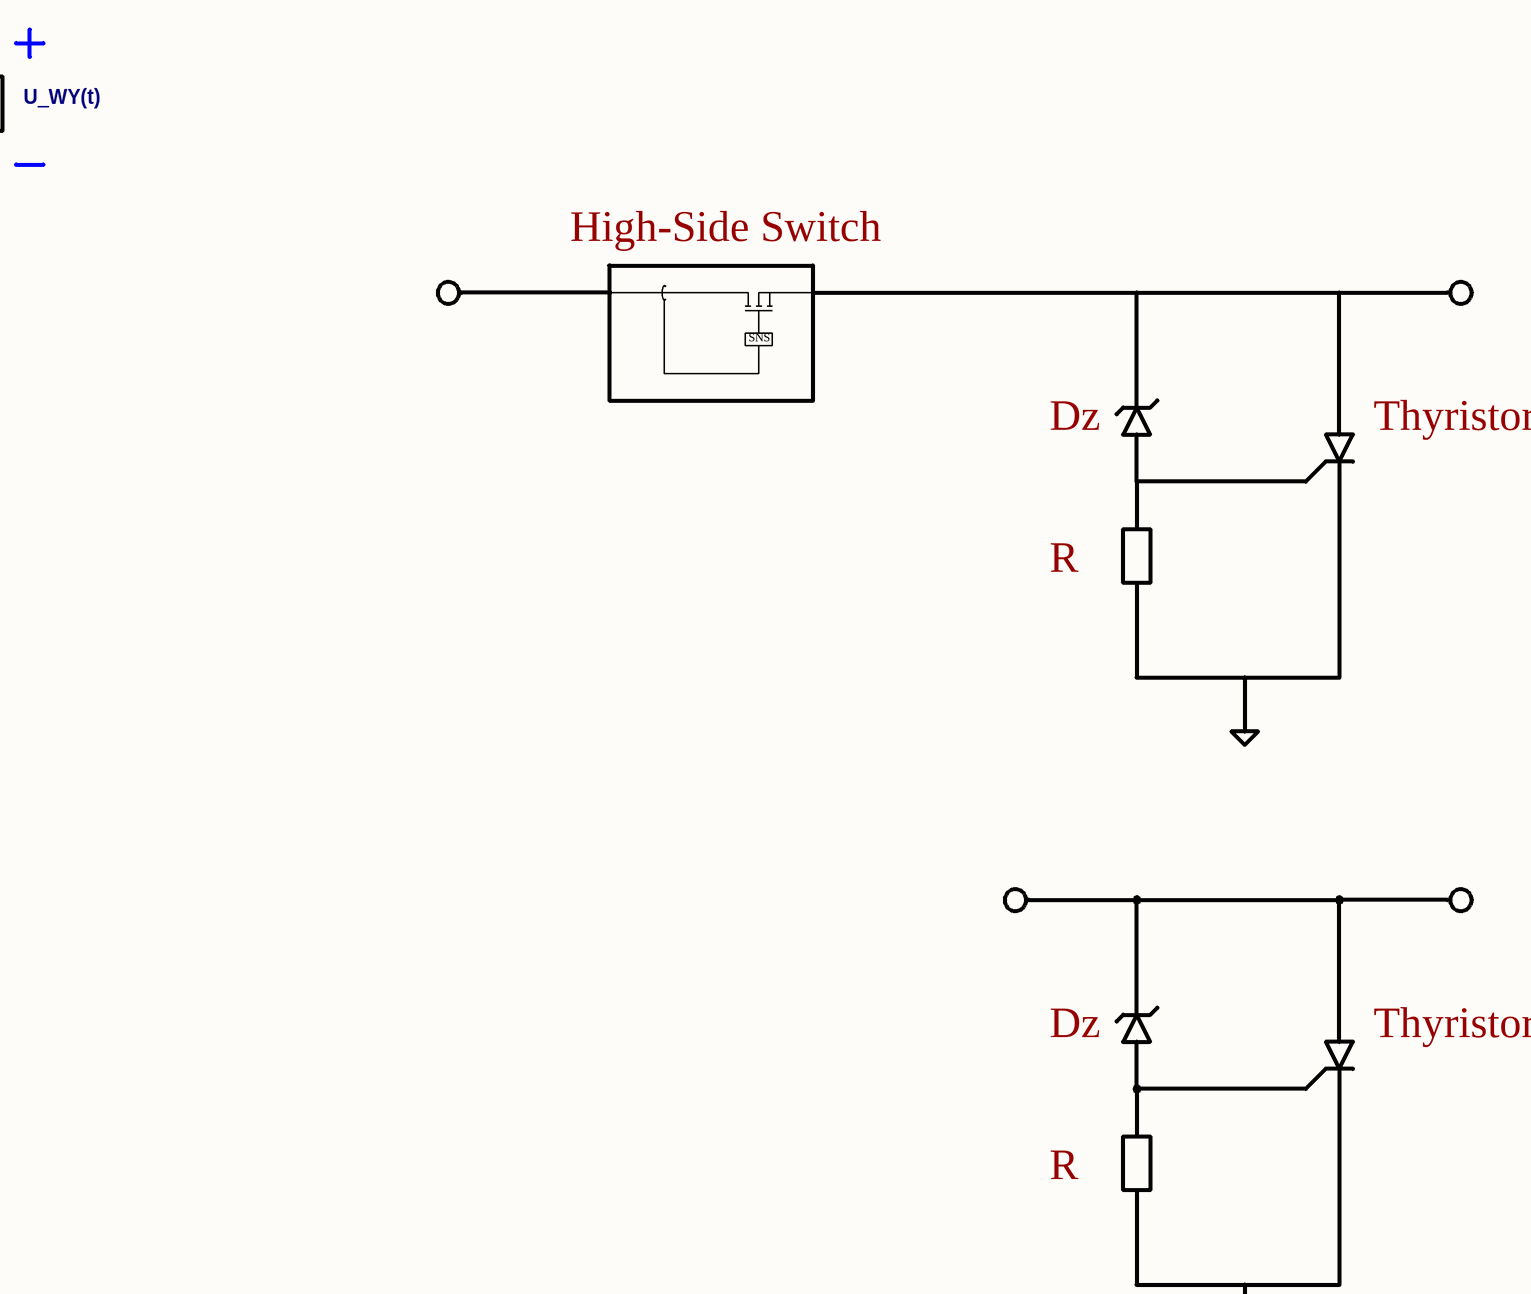
[diagram p18: Drawing.SchDoc, bottom middle]
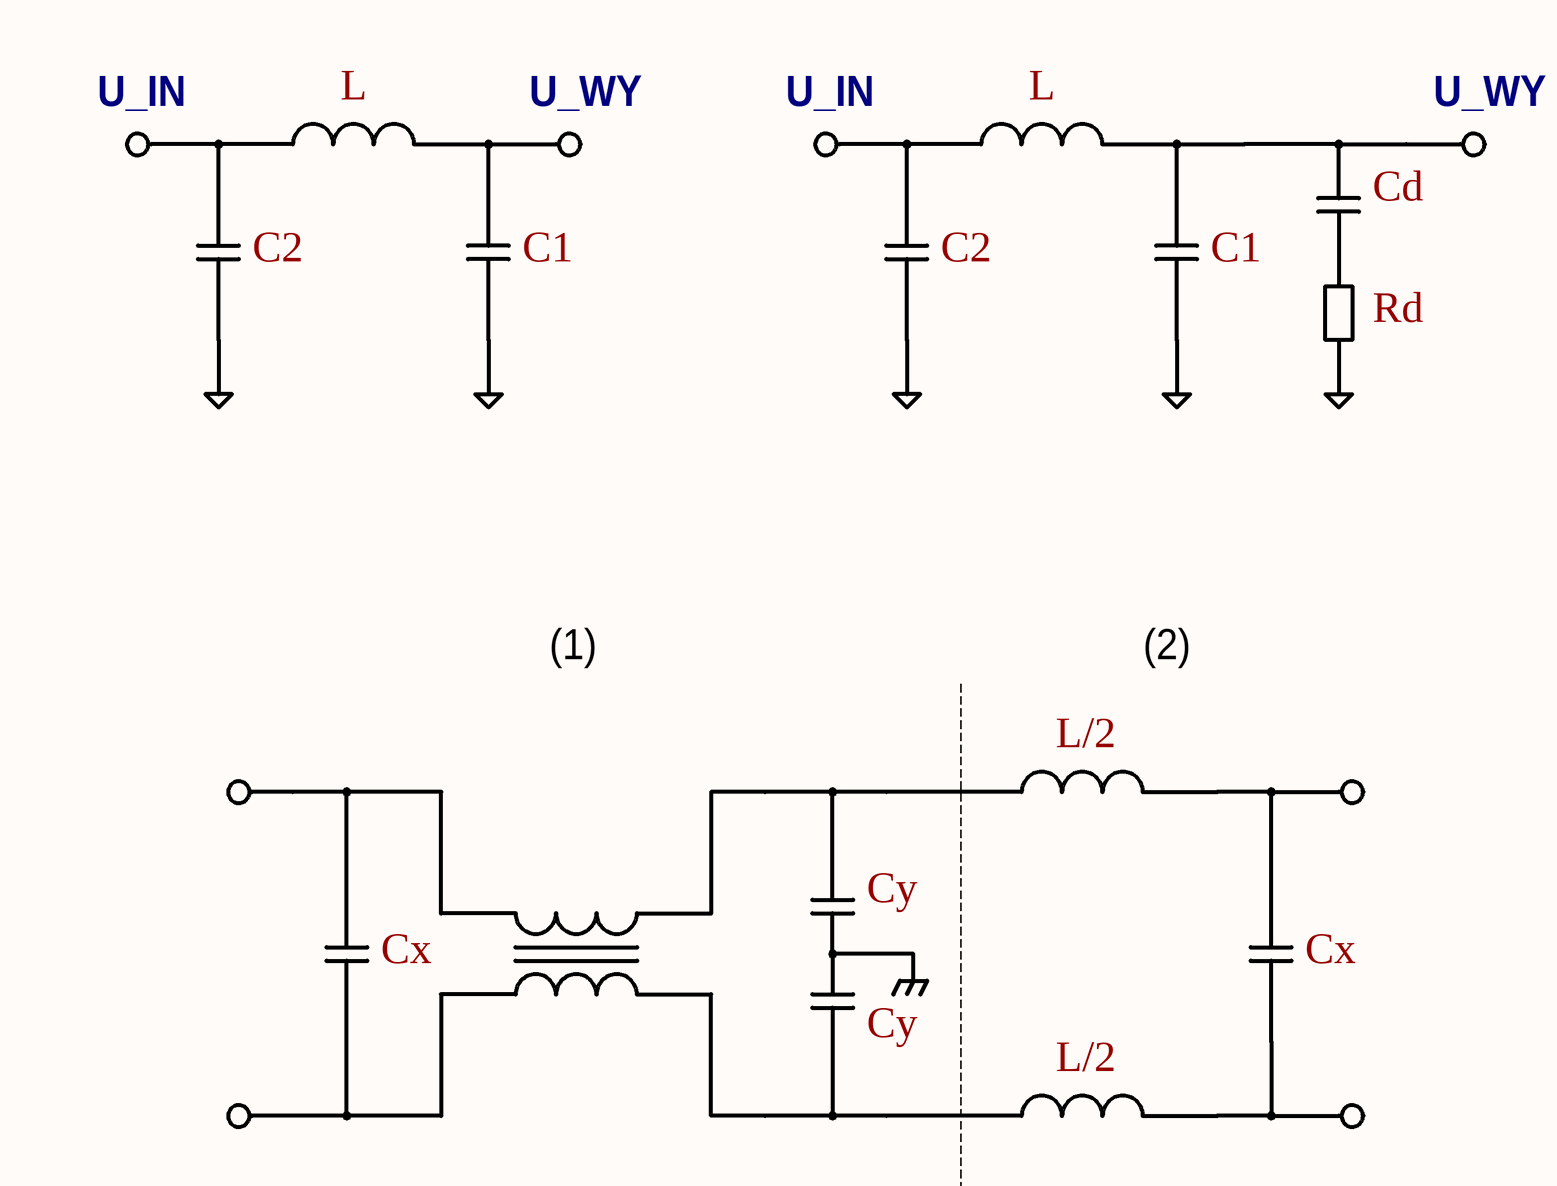
[diagram p19: Drawing.SchDoc, bottom right]

### Notes on the sheet
- L
- U
- I
- R1
- U_WY
- D
- C
- R
- R2
- U2
- R3
- U_WY = U * G
- U = R * I
- U2 = U * R2/( R1+R2+R3)
- I = U_WY/(G * R)
- U_WY = U2 * G
- Generator PWM
- Kompensator
- V_REF
- U_REF
- ε*
- I*
- ε
- U*
- GENERATOR
- PWM
- Line
- PI
- i_C(t)
- I_WY
- Konwerter DC-DC
- U_WE(t)
- u_L(t)
- U_WY(t)
- ON
- Q1
- PWM C
- Q3
- KONTROLER PID
- Return
- K
- P
- REF
- 1
- s
- SYSTEM
- OFF
- Q2
- PWM D
- Q4
- U_IN
- GND/Return
- Cd
- C2
- C1
- u_D(t)
- Rd
- High-Side Switch
- SNS
- Dz
- Thyristor
- (1)
- (2)
- L/2
- Cy
- Cx
- Nazwa projektu
- Nazwa dokumentu
- Nazwa firmy:
- Autor:
- Osoba sprawdzająca:
- Data: